# EAGLE design Matrix_Game_Board (EAGLE 6.5.0)
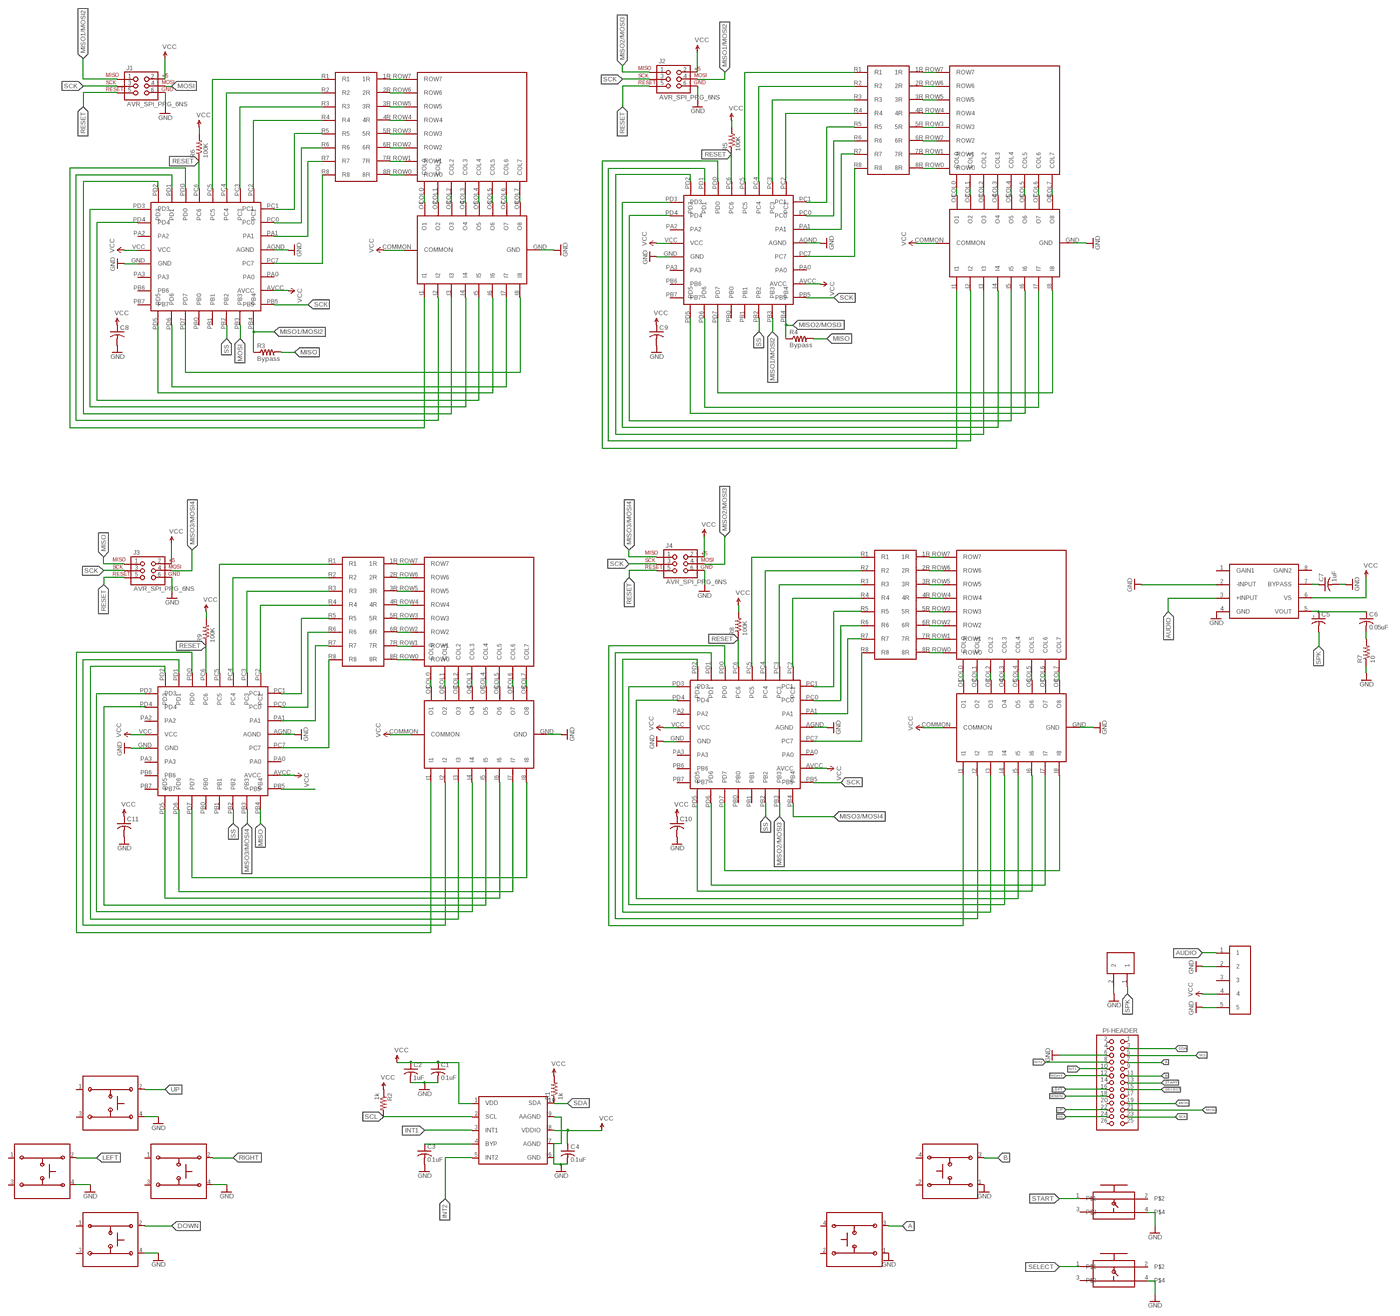
[diagram p0: schematic, sheet 1, overview]
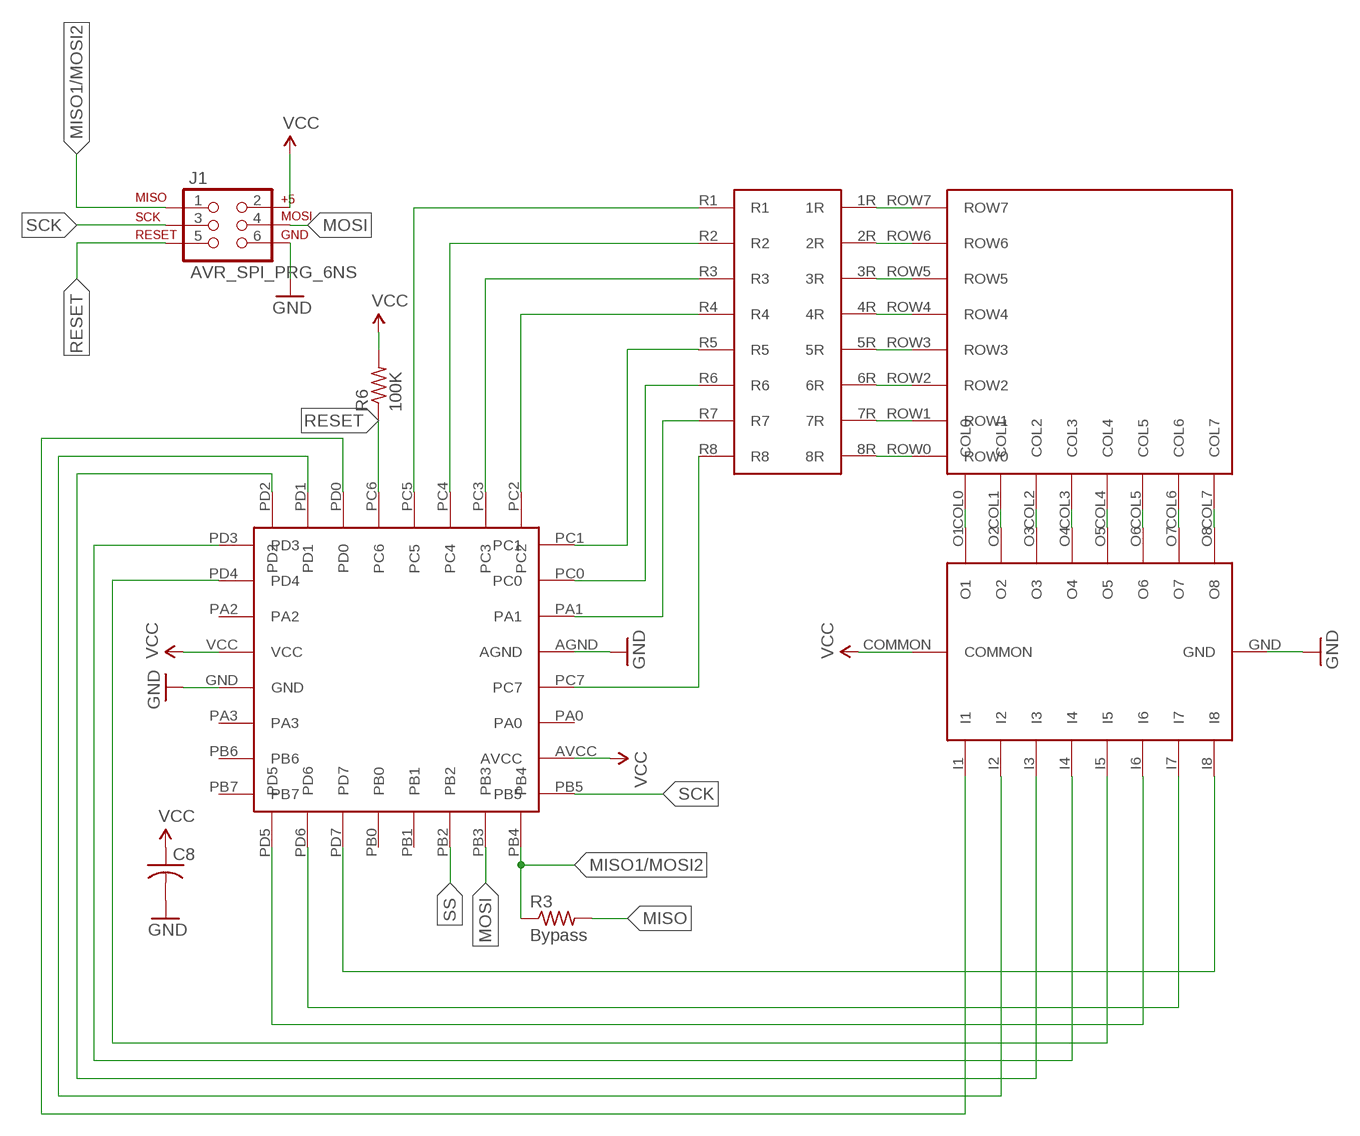
[diagram p1: schematic, sheet 1, part 1 of 4]
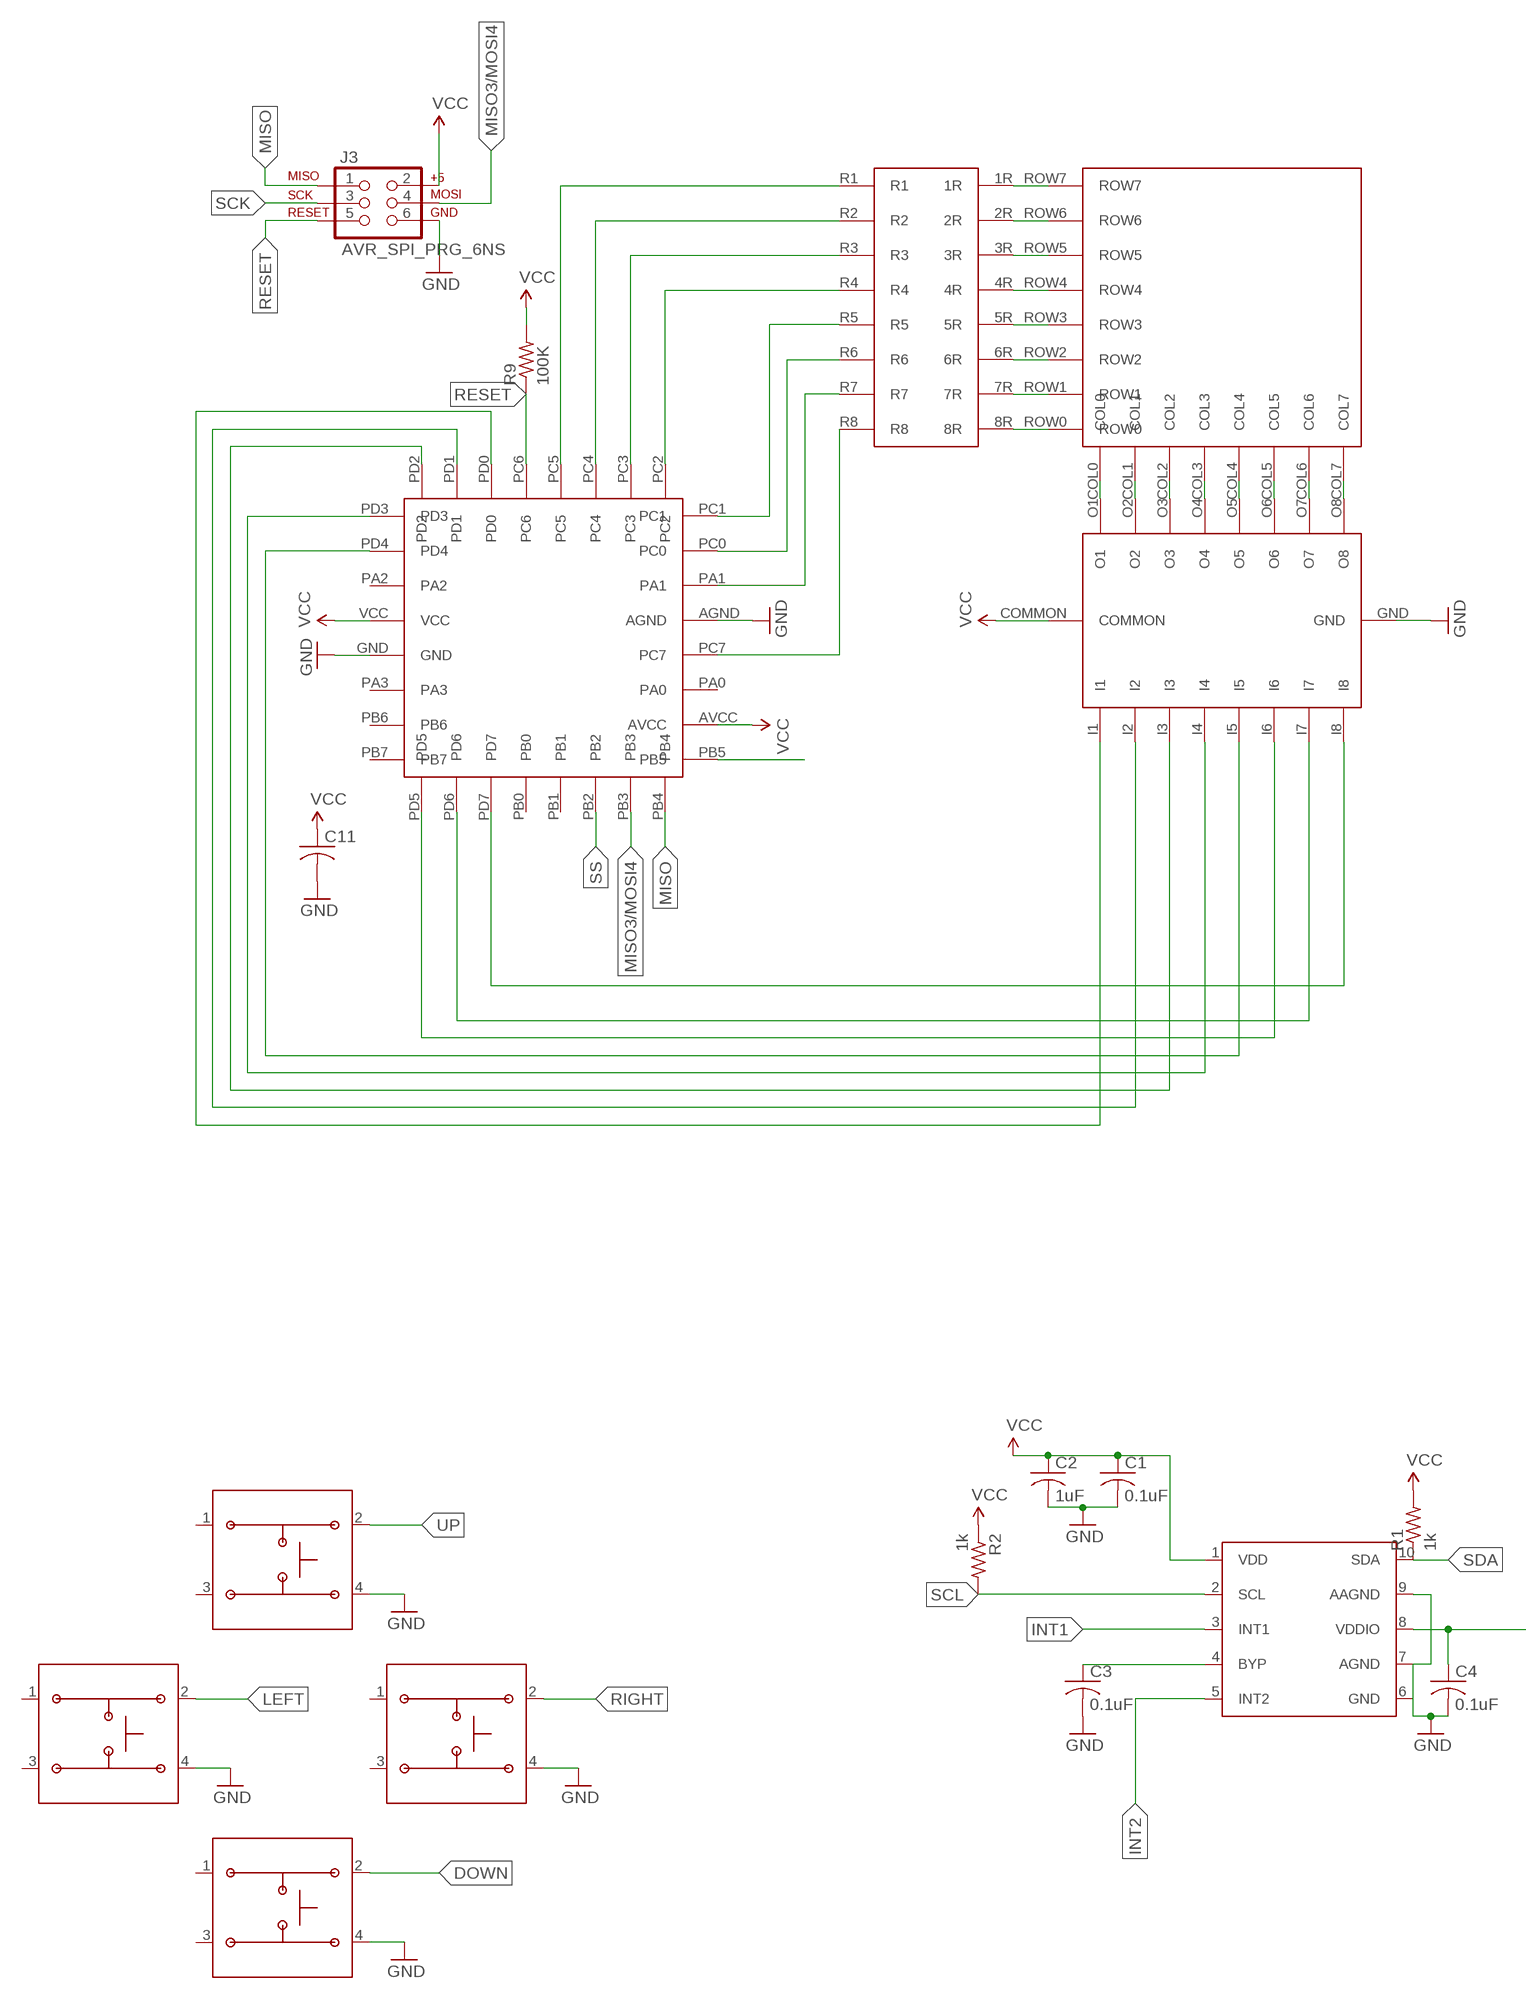
[diagram p2: schematic, sheet 1, part 2 of 4]
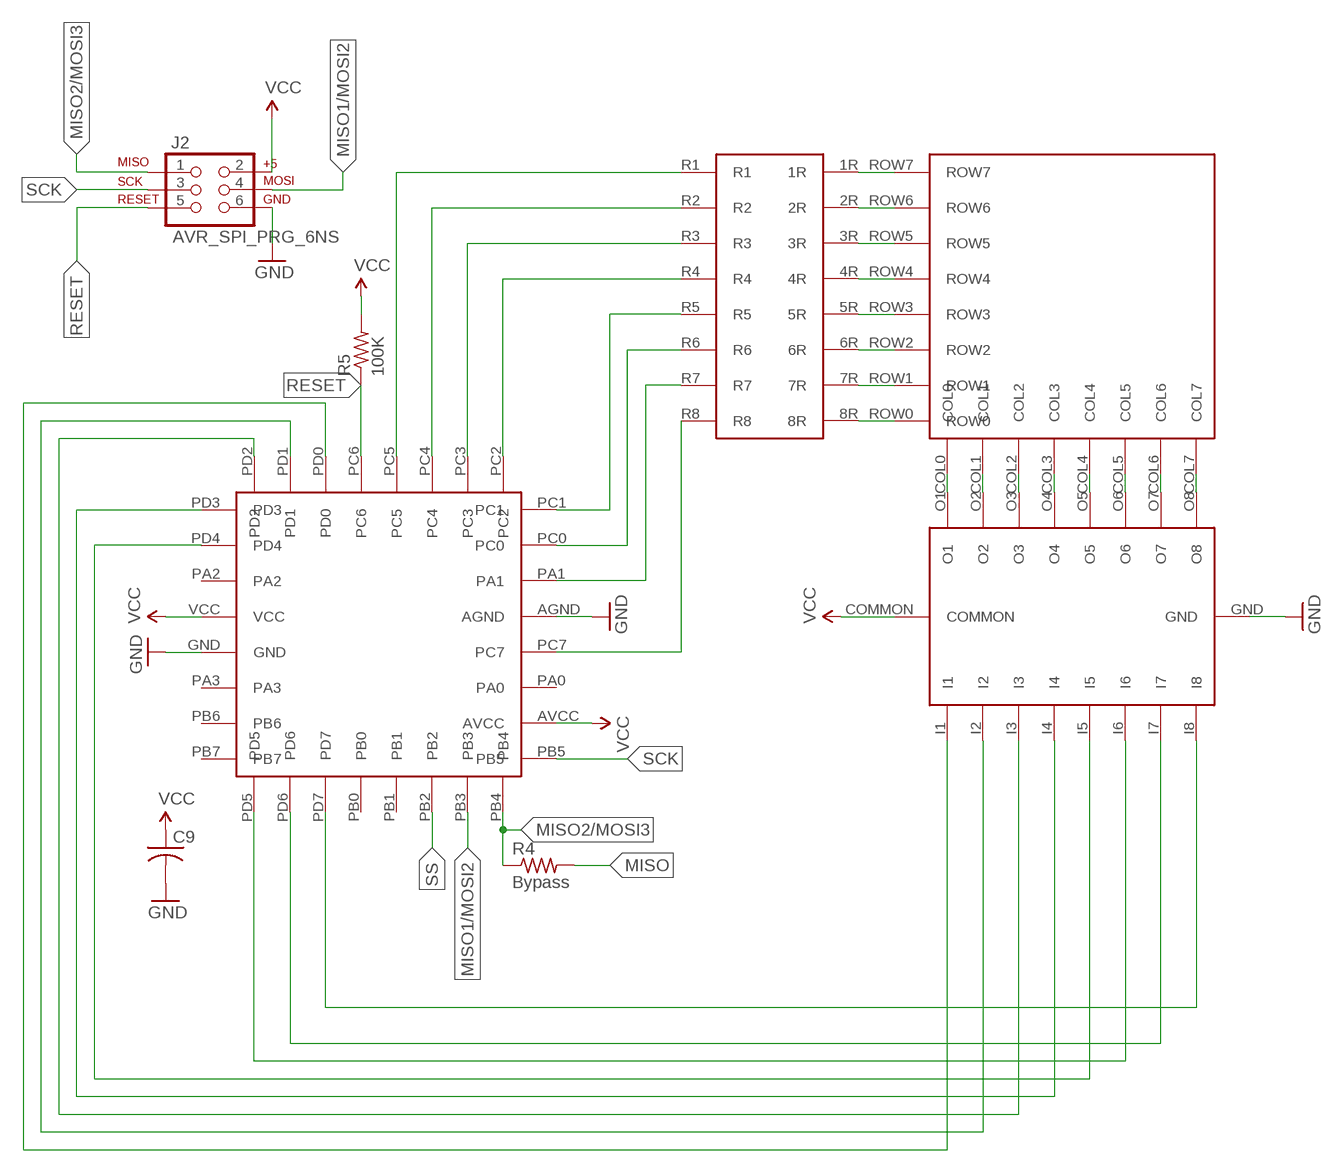
[diagram p3: schematic, sheet 1, part 3 of 4]
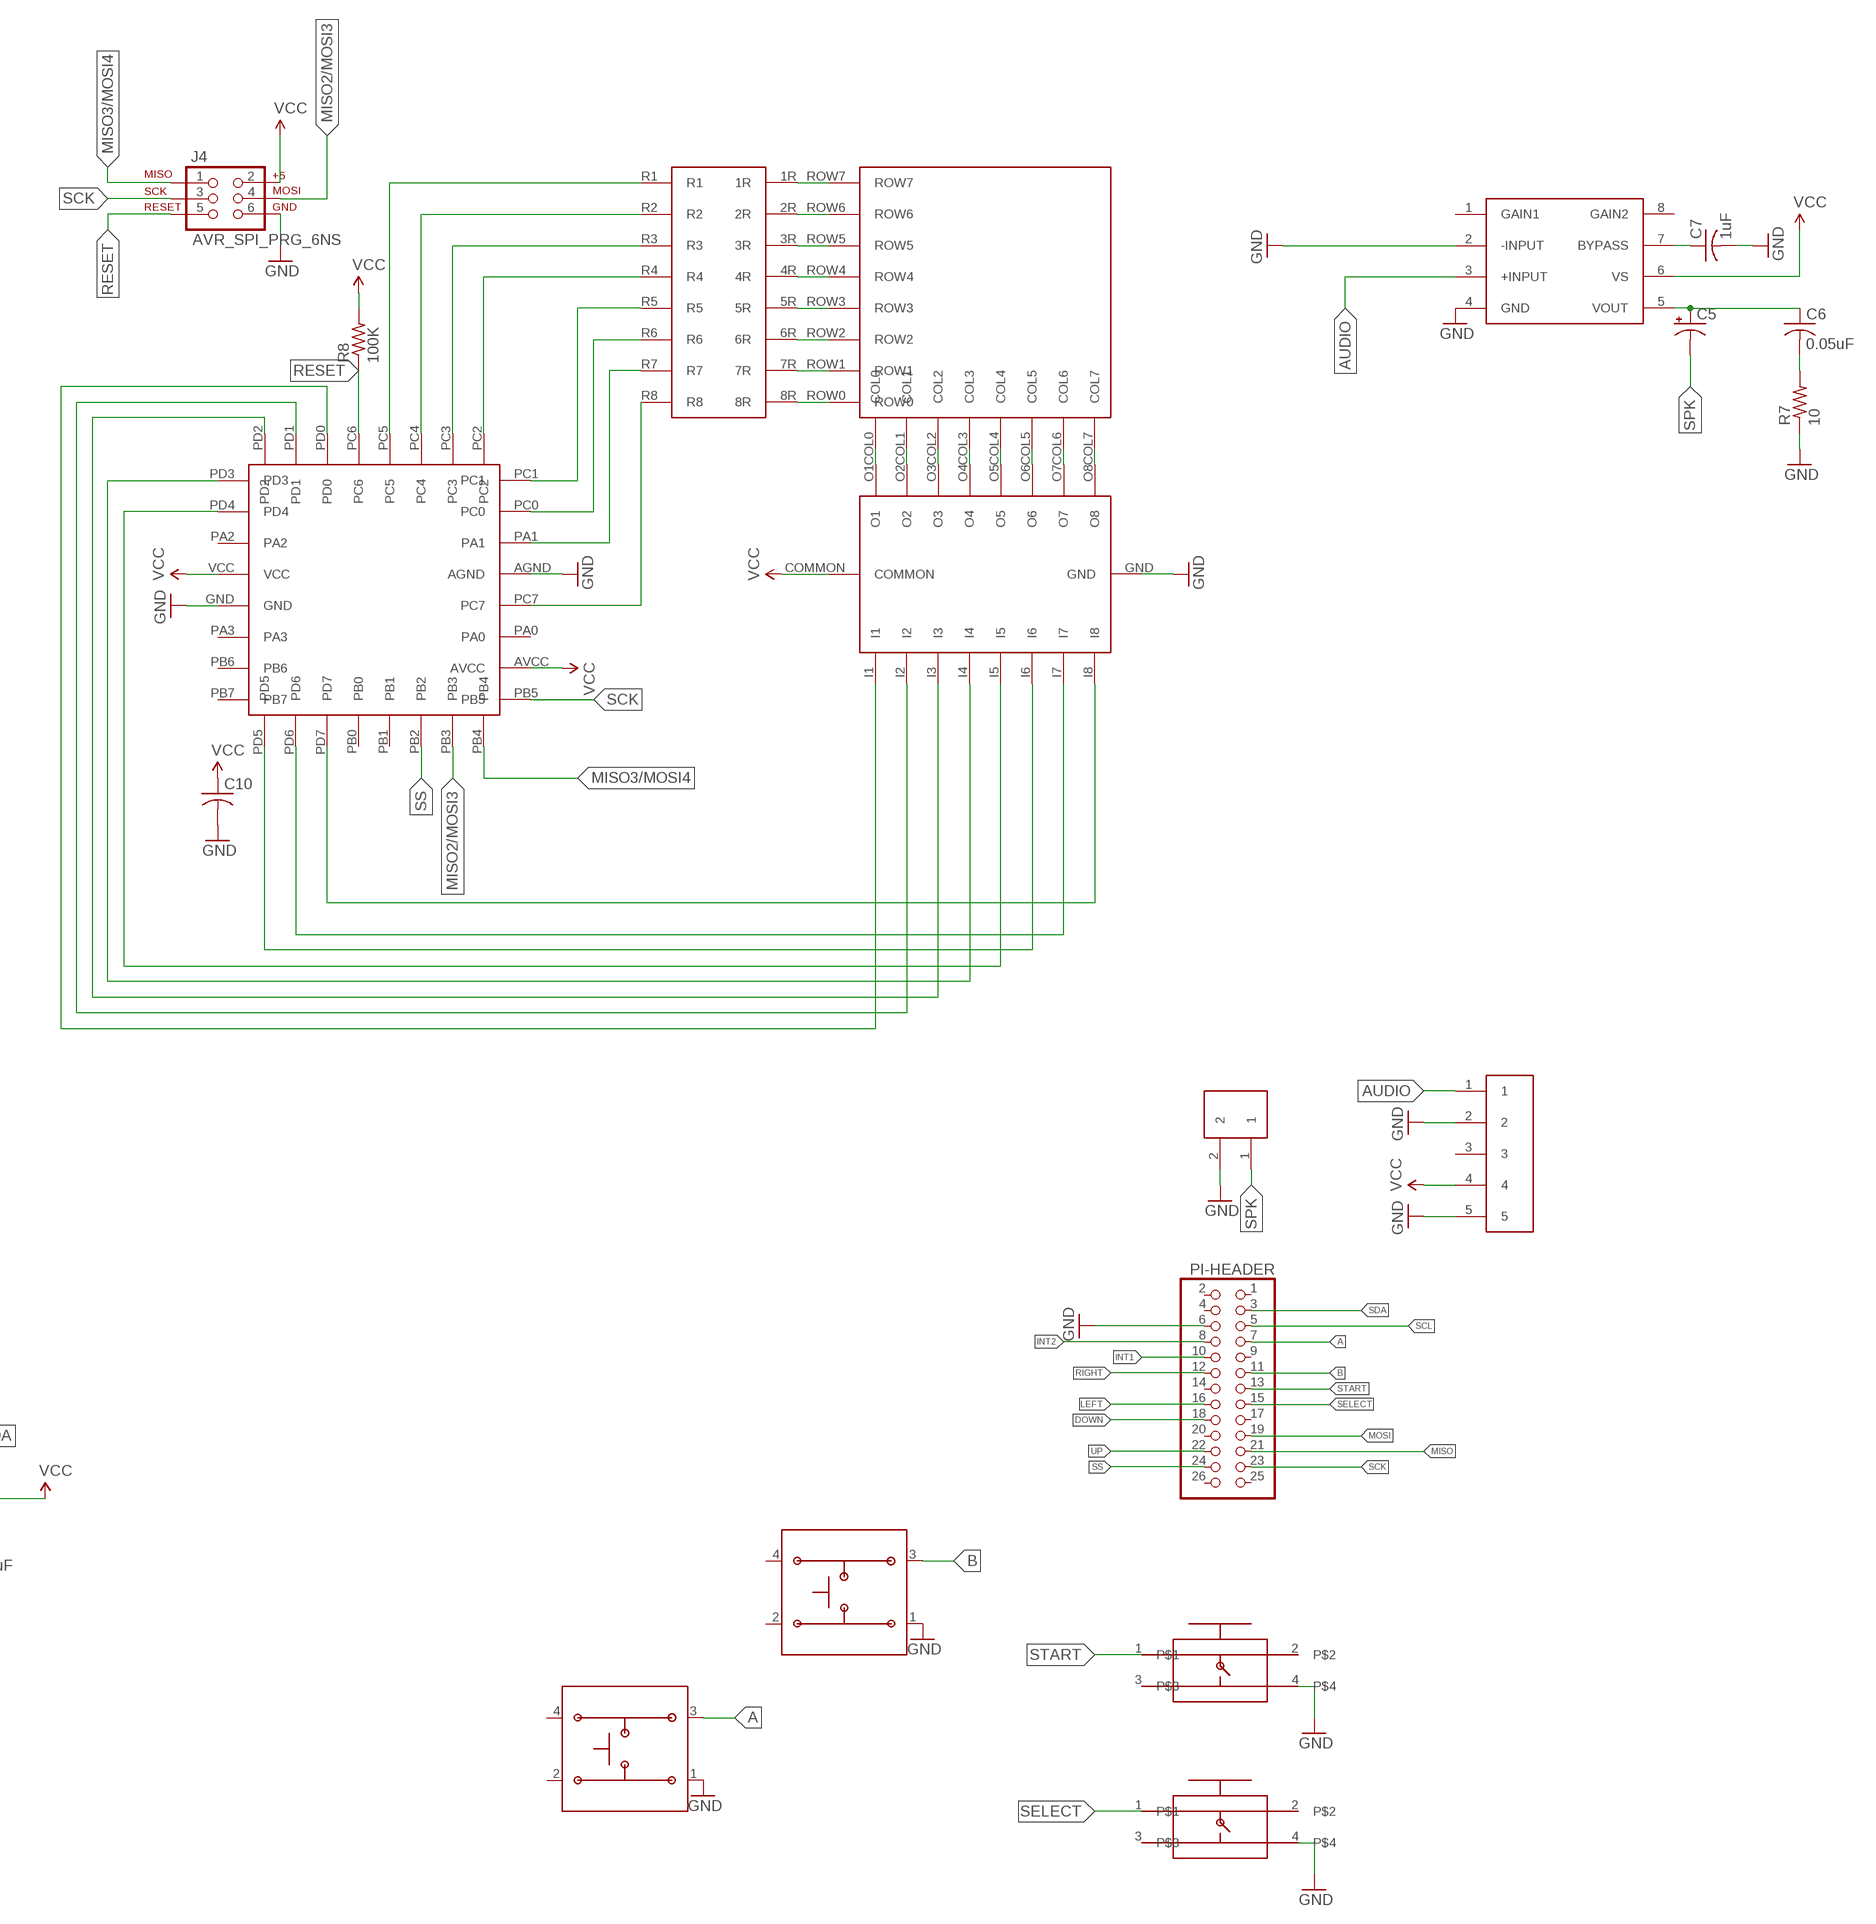
[diagram p4: schematic, sheet 1, part 4 of 4]

## Parts
C1  0.1uF  C-USC0603  [C0603]
C2  1uF  C-USC0603  [C0603]
C3  0.1uF  C-USC0603  [C0603]
C4  0.1uF  C-USC0603  [C0603]
C5  CPOL-US153CLV-0605  [153CLV-0605]
C6  0.05uF  C-USC0603  [C0603]
C7  1uF  C-USC0603  [C0603]
C8  C-USC0603  [C0603]
C9  C-USC0603  [C0603]
C10  C-USC0603  [C0603]
C11  C-USC0603  [C0603]
J1  AVR_SPI_PRG_6NS  [2X3-NS]
J2  AVR_SPI_PRG_6NS  [2X3-NS]
J3  AVR_SPI_PRG_6NS  [2X3-NS]
J4  AVR_SPI_PRG_6NS  [2X3-NS]
PI-HEADER  PINHD-2X13  [2X13]
R1  1k  R-US_R0603  [R0603]
R2  1k  R-US_R0603  [R0603]
R3  Bypass  R-US_R0603  [R0603]
R4  Bypass  R-US_R0603  [R0603]
R5  100K  R-US_R0603  [R0603]
R6  100K  R-US_R0603  [R0603]
R7  10  R-US_R0603  [R0603]
R8  100K  R-US_R0603  [R0603]
R9  100K  R-US_R0603  [R0603]
U$1  8X8_LED_MATRIX  [8X8_LED_MATRIX]
U$2  RES_ARRAY  [RES_ARRAY]
U$3  8X8_LED_MATRIX  [8X8_LED_MATRIX]
U$4  ULN2803AFWG  [ULN2803AFWG]
U$5  ULN2803AFWG  [ULN2803AFWG]
U$6  ATTINY48  [ATTINY48]
U$7  RES_ARRAY  [RES_ARRAY]
U$8  8X8_LED_MATRIX  [8X8_LED_MATRIX]
U$9  ATTINY48  [ATTINY48]
U$10  ULN2803AFWG  [ULN2803AFWG]
U$11  ATTINY48  [ATTINY48]
U$12  RES_ARRAY  [RES_ARRAY]
U$13  8X8_LED_MATRIX  [8X8_LED_MATRIX]
U$14  ULN2803AFWG  [ULN2803AFWG]
U$15  ATTINY48  [ATTINY48]
U$16  RES_ARRAY  [RES_ARRAY]
U$17  12X12MM_BUTTON  [12X12MM_BUTTON]
U$18  12X12MM_BUTTON  [12X12MM_BUTTON]
U$19  12X12MM_BUTTON  [12X12MM_BUTTON]
U$20  12X12MM_BUTTON  [12X12MM_BUTTON]
U$21  12X12MM_BUTTON  [12X12MM_BUTTON]
U$22  12X12MM_BUTTON  [12X12MM_BUTTON]
U$23  MMA8653FCR1  [MMA8653FCR1]
U$24  SMDTACTILE  [SMDTACTILE]
U$25  LM386  [LM386]
U$26  SMDTACTILE  [SMDTACTILE]
U$29  DF3_1X2  [DF3_1X2]
U$30  DF3_1X5  [DF3_1X5]

## Nets
A: PI-HEADER.7 U$22.3
AUDIO: U$25.3(+INPUT) U$30.1
B: PI-HEADER.11 U$21.3
DOWN: PI-HEADER.18 U$20.2
GND: C1.2 C2.2 C3.2 C4.2 C7.2 C8.2 C9.2 C10.2 C11.2 J1.6 J2.6 J3.6 J4.6 PI-HEADER.6 R7.1 U$4.GND U$5.GND U$6.AGND U$6.GND U$9.AGND U$9.GND U$10.GND U$11.AGND U$11.GND U$14.GND U$15.AGND U$15.GND U$17.4 U$18.4 U$19.4 U$20.4 U$21.1 U$22.1 U$23.6(GND) U$23.7(AGND) U$23.9(AAGND) U$24.4 U$25.2(-INPUT) U$25.4(GND) U$26.4 U$29.2 U$30.2 U$30.5
INT1: PI-HEADER.10 U$23.3(INT1)
INT2: PI-HEADER.8 U$23.5(INT2)
LEFT: PI-HEADER.16 U$18.2
MISO: J3.1 PI-HEADER.21 R3.2 R4.2 U$11.PB4
MISO1/MOSI2: J1.1 J2.4 R3.1 U$6.PB3 U$9.PB4
MISO2/MOSI3: J2.1 J4.4 R4.1 U$6.PB4 U$15.PB3
MISO3/MOSI4: J3.4 J4.1 U$11.PB3 U$15.PB4
MOSI: J1.4 PI-HEADER.19 U$9.PB3
N$1: U$1.COL0 U$5.O1
N$2: U$1.COL1 U$5.O2
N$3: U$1.COL2 U$5.O3
N$4: U$1.COL3 U$5.O4
N$5: U$1.COL4 U$5.O5
N$6: U$1.COL5 U$5.O6
N$7: U$1.COL6 U$5.O7
N$8: U$1.COL7 U$5.O8
N$9: U$1.ROW7 U$2.1R
N$10: U$1.ROW6 U$2.2R
N$11: U$1.ROW5 U$2.3R
N$12: U$1.ROW4 U$2.4R
N$13: U$1.ROW3 U$2.5R
N$14: U$1.ROW2 U$2.6R
N$15: U$1.ROW1 U$2.7R
N$16: U$1.ROW0 U$2.8R
N$17: U$5.I1 U$9.PD0
N$18: U$5.I2 U$9.PD1
N$19: U$5.I3 U$9.PD2
N$20: U$5.I4 U$9.PD3
N$21: U$5.I5 U$9.PD4
N$22: U$5.I6 U$9.PD5
N$23: U$5.I7 U$9.PD6
N$24: U$5.I8 U$9.PD7
N$25: U$2.R7 U$9.PA1
N$26: U$2.R8 U$9.PC7
N$27: U$2.R6 U$9.PC0
N$28: U$2.R5 U$9.PC1
N$29: U$2.R4 U$9.PC2
N$30: U$2.R3 U$9.PC3
N$31: U$2.R2 U$9.PC4
N$32: U$2.R1 U$9.PC5
N$33: C7.1 U$25.7(BYPASS)
N$34: C3.1 U$23.4(BYP)
N$35: C5.+ C6.1 U$25.5(VOUT)
N$36: U$3.COL0 U$4.O1
N$37: C6.2 R7.2
N$38: U$3.COL1 U$4.O2
N$39: U$3.COL2 U$4.O3
N$40: U$3.COL3 U$4.O4
N$41: U$3.COL4 U$4.O5
N$42: U$3.COL5 U$4.O6
N$43: U$3.COL6 U$4.O7
N$44: U$3.COL7 U$4.O8
N$45: U$3.ROW7 U$7.1R
N$46: U$3.ROW6 U$7.2R
N$47: U$3.ROW5 U$7.3R
N$48: U$3.ROW4 U$7.4R
N$49: U$3.ROW3 U$7.5R
N$50: U$3.ROW2 U$7.6R
N$51: U$3.ROW1 U$7.7R
N$52: U$3.ROW0 U$7.8R
N$53: U$4.I1 U$6.PD0
N$54: U$4.I2 U$6.PD1
N$55: U$4.I3 U$6.PD2
N$56: U$4.I4 U$6.PD3
N$57: U$4.I5 U$6.PD4
N$58: U$4.I6 U$6.PD5
N$59: U$4.I7 U$6.PD6
N$60: U$4.I8 U$6.PD7
N$61: U$6.PA1 U$7.R7
N$62: U$6.PC7 U$7.R8
N$63: U$6.PC0 U$7.R6
N$64: U$6.PC1 U$7.R5
N$65: U$6.PC2 U$7.R4
N$66: U$6.PC3 U$7.R3
N$67: U$6.PC4 U$7.R2
N$68: U$6.PC5 U$7.R1
N$69: U$15.PA1 U$16.R7
N$70: U$8.COL0 U$10.O1
N$71: U$8.COL1 U$10.O2
N$72: U$8.COL2 U$10.O3
N$73: U$8.COL3 U$10.O4
N$74: U$8.COL4 U$10.O5
N$75: U$8.COL5 U$10.O6
N$76: U$8.COL6 U$10.O7
N$77: U$8.COL7 U$10.O8
N$78: U$8.ROW7 U$12.1R
N$79: U$8.ROW6 U$12.2R
N$80: U$8.ROW5 U$12.3R
N$81: U$8.ROW4 U$12.4R
N$82: U$8.ROW3 U$12.5R
N$83: U$8.ROW2 U$12.6R
N$84: U$8.ROW1 U$12.7R
N$85: U$8.ROW0 U$12.8R
N$86: U$10.I1 U$11.PD0
N$87: U$10.I2 U$11.PD1
N$88: U$10.I3 U$11.PD2
N$89: U$10.I4 U$11.PD3
N$90: U$10.I5 U$11.PD4
N$91: U$10.I6 U$11.PD5
N$92: U$10.I7 U$11.PD6
N$93: U$10.I8 U$11.PD7
N$94: U$11.PA1 U$12.R7
N$95: U$11.PC7 U$12.R8
N$96: U$11.PC0 U$12.R6
N$97: U$11.PC1 U$12.R5
N$98: U$11.PC2 U$12.R4
N$99: U$11.PC3 U$12.R3
N$100: U$11.PC4 U$12.R2
N$101: U$11.PC5 U$12.R1
N$102: U$15.PC7 U$16.R8
N$103: U$13.COL0 U$14.O1
N$104: U$13.COL1 U$14.O2
N$105: U$13.COL2 U$14.O3
N$106: U$13.COL3 U$14.O4
N$107: U$13.COL4 U$14.O5
N$108: U$13.COL5 U$14.O6
N$109: U$13.COL6 U$14.O7
N$110: U$13.COL7 U$14.O8
N$111: U$13.ROW7 U$16.1R
N$112: U$13.ROW6 U$16.2R
N$113: U$13.ROW5 U$16.3R
N$114: U$13.ROW4 U$16.4R
N$115: U$13.ROW3 U$16.5R
N$116: U$13.ROW2 U$16.6R
N$117: U$13.ROW1 U$16.7R
N$118: U$13.ROW0 U$16.8R
N$119: U$14.I1 U$15.PD0
N$120: U$14.I2 U$15.PD1
N$121: U$14.I3 U$15.PD2
N$122: U$14.I4 U$15.PD3
N$123: U$14.I5 U$15.PD4
N$124: U$14.I6 U$15.PD5
N$125: U$14.I7 U$15.PD6
N$126: U$14.I8 U$15.PD7
N$129: U$15.PC0 U$16.R6
N$130: U$15.PC1 U$16.R5
N$131: U$15.PC2 U$16.R4
N$132: U$15.PC3 U$16.R3
N$133: U$15.PC4 U$16.R2
N$134: U$15.PC5 U$16.R1
RESET: J1.5 J2.5 J3.5 J4.5 R5.1 R6.1 R8.1 R9.1 U$6.PC6 U$9.PC6 U$11.PC6 U$15.PC6
RIGHT: PI-HEADER.12 U$19.2
SCK: J1.3 J2.3 J3.3 J4.3 PI-HEADER.23 U$6.PB5 U$9.PB5 U$11.PB5 U$15.PB5
SCL: PI-HEADER.5 R2.2 U$23.2(SCL)
SDA: PI-HEADER.3 R1.1 U$23.10(SDA)
SELECT: PI-HEADER.15 U$26.1
SPK: C5.- U$29.1
SS: PI-HEADER.24 U$6.PB2 U$9.PB2 U$11.PB2 U$15.PB2
START: PI-HEADER.13 U$24.1
UP: PI-HEADER.22 U$17.2
VCC: C1.1 C2.1 C4.1 C8.1 C9.1 C10.1 C11.1 J1.2 J2.2 J3.2 J4.2 R1.2 R2.1 R5.2 R6.2 R8.2 R9.2 U$4.COMMON U$5.COMMON U$6.AVCC U$6.VCC U$9.AVCC U$9.VCC U$10.COMMON U$11.AVCC U$11.VCC U$14.COMMON U$15.AVCC U$15.VCC U$23.1(VDD) U$23.8(VDDIO) U$25.6(VS) U$30.4
Unconnected: PI-HEADER.1 PI-HEADER.2 PI-HEADER.4 PI-HEADER.9 PI-HEADER.14 PI-HEADER.17 PI-HEADER.20 PI-HEADER.25 PI-HEADER.26 U$6.PA0 U$6.PA2 U$6.PA3 U$6.PB0 U$6.PB1 U$6.PB6 U$6.PB7 U$9.PA0 U$9.PA2 U$9.PA3 U$9.PB0 U$9.PB1 U$9.PB6 U$9.PB7 U$11.PA0 U$11.PA2 U$11.PA3 U$11.PB0 U$11.PB1 U$11.PB6 U$11.PB7 U$15.PA0 U$15.PA2 U$15.PA3 U$15.PB0 U$15.PB1 U$15.PB6 U$15.PB7 U$17.1 U$17.3 U$18.1 U$18.3 U$19.1 U$19.3 U$20.1 U$20.3 U$21.2 U$21.4 U$22.2 U$22.4 U$24.2 U$24.3 U$25.1(GAIN1) U$25.8(GAIN2) U$26.2 U$26.3 U$30.3

## Library data of the parts
C1-C4 C6-C11 = resistor:C-US: CAPACITOR, American symbol
C5 = resistor:CPOL-US: POLARIZED CAPACITOR, American symbol
J1-J4 = SparkFun-Connectors:AVR_SPI_PRG_6: AVR ISP 6 Pin This is the reduced ISP connector for AVR programming. Common on Arduino. This footprint will take up less PCB space and can be used with a 10-pin to 6-pin adapter such as SKU: BOB-08508 **Special note about "TEST_POINT" package. The stop mask is on the top side, so if you want your programming test points to be on the bottom of your board, make sure to place this package on the bottom side of the board. This also ensure that the orientation to program from the bottom side will be correct.
PI-HEADER = pinhead:PINHD-2X13: PIN HEADER
R1-R9 = resistor:R-US_: RESISTOR, American symbol
U$1 U$3 U$8 U$13 = ScottSilver:8X8_LED_MATRIX
U$2 U$7 U$12 U$16 = ScottSilver:RES_ARRAY
U$4 U$5 U$10 U$14 = ScottSilver:ULN2803AFWG
U$6 U$9 U$11 U$15 = ScottSilver:ATTINY48
U$17-U$22 = ScottSilver:12X12MM_BUTTON
U$23 = ScottSilver:MMA8653FCR1
U$24 U$26 = ScottSilver:SMDTACTILE
U$25 = ScottSilver:LM386
U$29 = ScottSilver:DF3_1X2
U$30 = ScottSilver:DF3_1X5

## Board
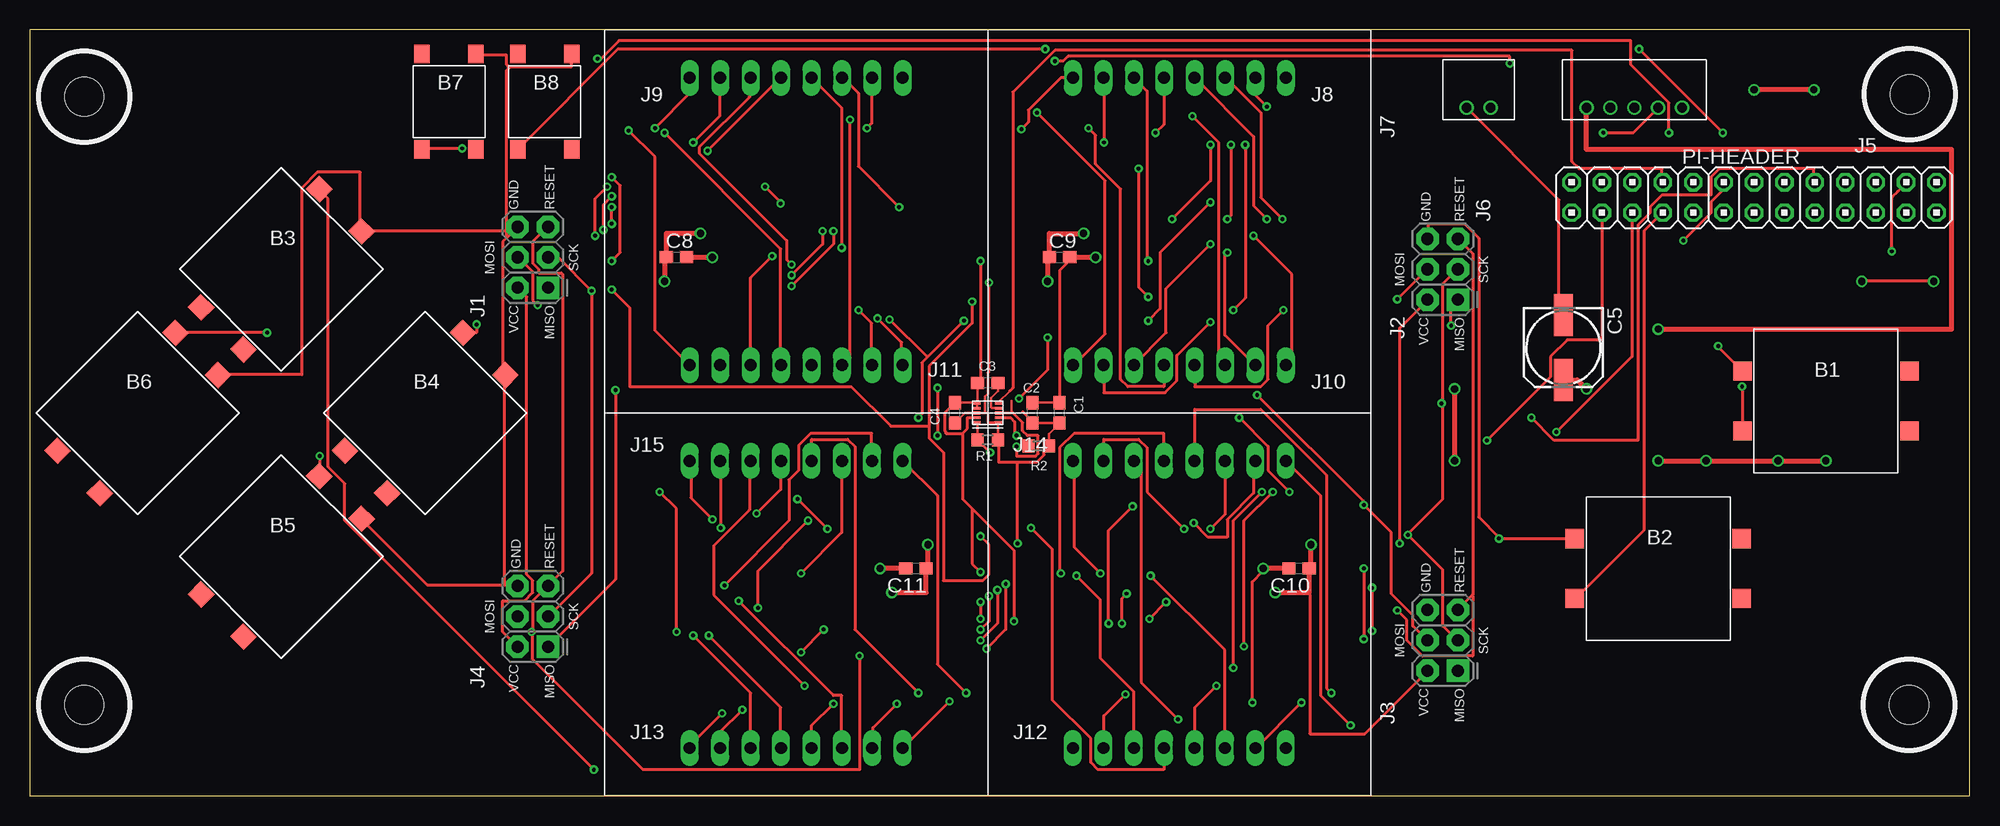
[diagram p5: board, top side]
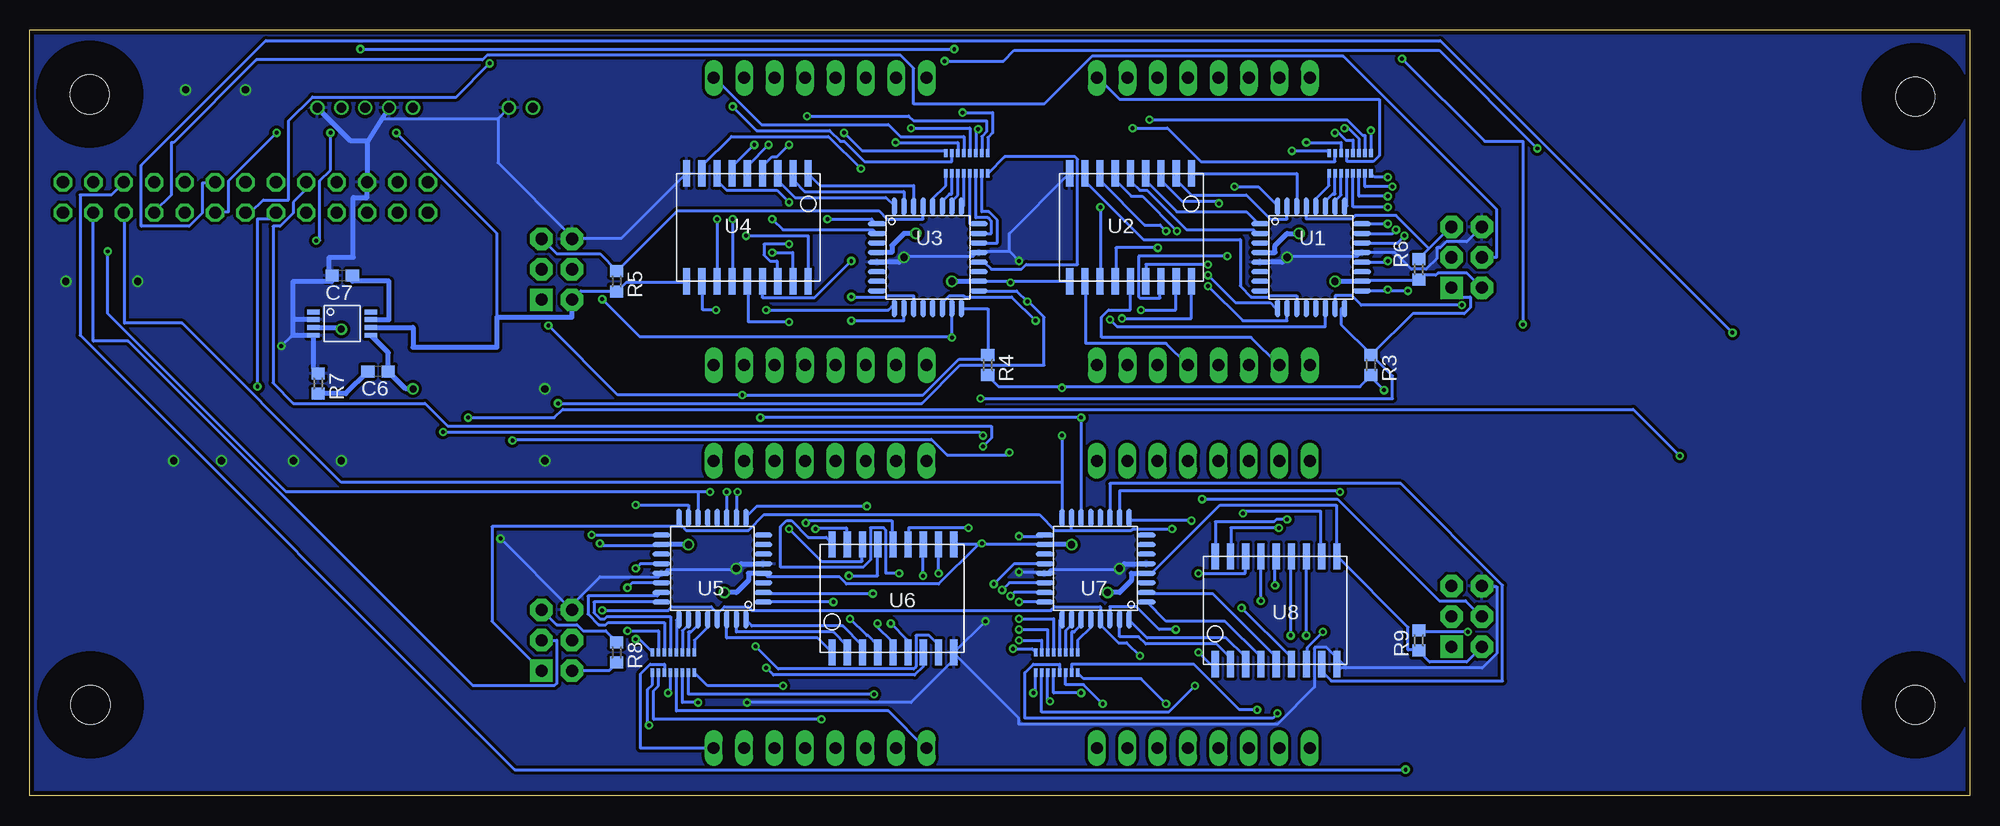
[diagram p6: board, bottom side, seen from below]

Size 162 x 64 mm. Coordinates in mm from the lower left corner, seen from the top.
Outline: 0,0 162,0 162,64 0,64 0,0
Copper layers (1*16): Top 0.0356mm / dielectric 1.5011mm / Bottom 0.0356mm
Design rules "LaenPCBOrder *": minimum track width 8mil, minimum drill 13mil, track to track 6mil, track to pad 6mil, pad to pad 6mil, via to via 6mil, smd to smd 6mil, copper to edge 15mil, drill to drill 6mil, minimum pad ring 7mil, minimum via ring 7mil, stop-mask expansion 3mil, vias tented up to drill 0mil, thermal gap 10mil
Holes 3.26 mm at 4.54,7.62 4.54,58.42 156.94,7.62 157,58.62
tRestrict: area 0.5,3.6 to 8.5,11.6; area 0.5,54.4 to 8.5,62.4; area 152.9,3.6 to 160.9,11.6; area 153,54.6 to 161,62.6; area 135,38 to 162,40; area 160.5,38 to 162,55; area 129,53 to 162,55; area 129,53 to 131,59
bRestrict: area 0.5,3.6 to 8.5,11.6; area 0.5,54.4 to 8.5,62.4; area 152.9,3.6 to 160.9,11.6; area 153,54.6 to 161,62.6
vRestrict: area 86,58 to 106,62; area 86,34 to 106,38; area 96,50 to 108,54; area 96,41 to 108,45; area 84,10 to 96,14; area 84,19 to 96,23; area 64,50 to 76,54; area 52,9 to 64,13; area 52,18 to 64,22; area 64,41 to 76,45; area 81,51 to 87,55; area 54,58 to 74,62; 16 more areas

### Footprints (pad centres in the part's own frame; a part is rotated, then mirrored left to right if it is on the bottom)
C0603 = smd 1.1 x 1: 1 -0.85,0; 2 0.85,0
153CLV-0605 = smd 3.5 x 1.6: + 2.7,0; - -2.7,0
2X3-NS = drill 1.016 pad 1.88 square: 1 -2.54,-1.27 | drill 1.016 pad 1.88 octagon: 2 -2.54,1.27; 3 0,-1.27; 4 0,1.27; 5 2.54,-1.27; 6 2.54,1.27
2X13 = drill 1.016 octagon: 1 -15.24,-1.27; 2 -15.24,1.27; 3 -12.7,-1.27; 4 -12.7,1.27; 5 -10.16,-1.27; 6 -10.16,1.27; 7 -7.62,-1.27; 8 -7.62,1.27; 9 -5.08,-1.27; 10 -5.08,1.27; 11 -2.54,-1.27; 12 -2.54,1.27; 13 0,-1.27; 14 0,1.27; 15 2.54,-1.27; 16 2.54,1.27; 17 5.08,-1.27; 18 5.08,1.27; 19 7.62,-1.27; 20 7.62,1.27; 21 10.16,-1.27; 22 10.16,1.27; 23 12.7,-1.27; 24 12.7,1.27; 25 15.24,-1.27; 26 15.24,1.27
R0603 = smd 1 x 1.1: 1 -0.85,0; 2 0.85,0
8X8_LED_MATRIX = drill 1 long: COL0 8.89,-12; COL1 6.35,-12; COL2 -3.81,-12; COL3 -3.81,12; COL4 -6.35,-12; COL5 1.27,12; COL6 3.81,12; COL7 1.27,-12; ROW0 -8.89,-12; ROW1 3.81,-12; ROW2 -8.89,12; ROW3 -1.27,-12; ROW4 8.89,12; ROW5 -6.35,12; ROW6 6.35,12; ROW7 -1.27,12
RES_ARRAY = smd 0.7 x 0.3: 1R 1.7,3.5; 2R 1.7,3; 3R 1.7,2.5; 4R 1.7,2; 5R 1.7,1.5; 6R 1.7,1; 7R 1.7,0.5; 8R 1.7,0; R1 0,3.5; R2 0,3; R3 0,2.5; R4 0,2; R5 0,1.5; R6 0,1; R7 0,0.5; R8 0,0
ULN2803AFWG = smd 0.6 x 2.2: COMMON 10.16,9.01; GND 10.16,0; I1 0,0; I2 1.27,0; I3 2.54,0; I4 3.81,0; I5 5.08,0; I6 6.35,0; I7 7.62,0; I8 8.89,0; O1 0,9.01; O2 1.27,9.01; O3 2.54,9.01; O4 3.81,9.01; O5 5.08,9.01; O6 6.35,9.01; O7 7.62,9.01; O8 8.89,9.01
ATTINY48 = smd 1.5 x 0.406: AGND 4.25,0.4; AVCC 4.25,-2; GND -4.25,-0.4; PA0 4.25,-1.2; PA1 4.25,1.2; PA2 -4.25,1.2; PA3 -4.25,-1.2; PB5 4.25,-2.8; PB6 -4.25,-2; PB7 -4.25,-2.8; PC0 4.25,2; PC1 4.25,2.8; PC7 4.25,-0.4; PD3 -4.25,2.8; PD4 -4.25,2; VCC -4.25,0.4 | smd 0.406 x 1.5: PB0 -0.4,-4.25; PB1 0.4,-4.25; PB2 1.2,-4.25; PB3 2,-4.25; PB4 2.8,-4.25; PC2 2.8,4.25; PC3 2,4.25; PC4 1.2,4.25; PC5 0.4,4.25; PC6 -0.4,4.25; PD0 -1.2,4.25; PD1 -2,4.25; PD2 -2.8,4.25; PD5 -2.8,-4.25; PD6 -2,-4.25; PD7 -1.2,-4.25
12X12MM_BUTTON = smd 1.55 x 1.6: 1 -6.975,2.5; 2 6.975,2.5; 3 -6.975,-2.5; 4 6.975,-2.5
MMA8653FCR1 = smd 0.6 x 0.225: 1 -0.9,0.8; 2 -0.9,0.4; 3 -0.9,0; 4 -0.9,-0.4; 5 -0.9,-0.8; 6 0.9,-0.8; 7 0.9,-0.4; 8 0.9,0; 9 0.9,0.4; 10 0.9,0.8
SMDTACTILE = smd 1.55 x 1.3: 1 -3.975,2.25; 2 3.975,2.25; 3 -3.975,-2.25; 4 3.975,-2.25
LM386 = smd 0.41 x 1.02: 1 -0.975,-2.4; 2 -0.325,-2.4; 3 0.325,-2.4; 4 0.975,-2.4; 5 0.975,2.4; 6 0.325,2.4; 7 -0.325,2.4; 8 -0.975,2.4
DF3_1X2 = drill 0.8: 1 -1,-1.5; 2 1,-1.5
DF3_1X5 = drill 0.8: 1 -4,-1.5; 2 -2,-1.5; 3 0,-1.5; 4 2,-1.5; 5 4,-1.5

### Placement (x,y rotation side)
C1  86,32 90 top
C2  83.75,32 90 top
C3  80,34.5 180 top
C4  77.25,32 90 top
C5  128.08,37.46 270 top
C6  132.92,35.46 180 bottom
C7  135.92,43.46 180 bottom
C8  54,45 0 top
C9  86,45 0 top
C10  106,19 180 top
C11  74,19 180 top
J1  42,45 90 top
J2  118,44 90 top
J3  42,15 90 top
J4  118,13 90 top
PI-HEADER  144,50 0 top
R1  80,29.75 0 top
R2  84.25,29.25 180 top
R3  50,36 270 bottom
R4  82,36 270 bottom
R5  113,43 270 bottom
R6  46,44 270 bottom
R7  137.92,34.46 270 bottom
R8  113,12 270 bottom
R9  46,13 270 bottom
U$1  64,48 0 top
U$2  50,52 90 bottom
U$3  96,48 0 top
U$4  97,52 180 bottom
U$5  65,52 180 bottom
U$6  87,45 0 bottom
U$7  82,52 90 bottom
U$8  64,16 180 top
U$9  55,45 0 bottom
U$10  63,11 0 bottom
U$11  73,19 180 bottom
U$12  78,12 270 bottom
U$13  96,16 180 top
U$14  95,12 0 bottom
U$15  105,19 180 bottom
U$16  110,12 270 bottom
U$17  21,44 45 top
U$18  9,32 45 top
U$19  33,32 45 top
U$20  21,20 45 top
U$21  150,33 0 top
U$22  136,19 0 top
U$23  80,32 180 top
U$24  35,58 90 top
U$25  135.92,39.46 270 bottom
U$26  43,58 90 top
U$29  121,59 0 top
U$30  134,59 0 top

### Tracks (layer width: path | path; a pad name or v marks a point on that pad's centre or on a via)
A
  Top 0.254: U$22.3 129.1,16.5 134.8,22.2 134.8,47.2 136.3,48.7 PI-HEADER.7
AUDIO  (via drill 0.6)
  Top 0.406: U$30.1 130,54 160.5,54 160.5,39 v136,39
  Bottom 0.406: U$25.3 136,39.13 v136,39
B  (via drill 0.33)
  Top 0.254: v143,34.2 143,30.5 U$21.3
  Bottom 0.254: v143,34.2 143,48.2 142,48.2 141.5,48.7 PI-HEADER.11
DOWN  (via drill 0.33)
  Top 0.254: v24.2,28.4 24.2,26.7 U$20.2 | v125.4,31.6 127.3,29.7 134.3,29.7 134.3,47.7 135.3,48.7 135.3,49.2 136.3,50.2 140.4,50.2 140.4,51.7 141.1,52.4 149,52.4 149,51.3 PI-HEADER.18
  Bottom 0.254: v24.2,28.4 28.1,32.3 117.5,32.3 118.2,31.6 v125.4,31.6
GND  (via drill 0.33, 0.6)
  Top 0.203: C4.2 79.05,32.85 U$23.6 | C3.2 79.15,32.85 U$23.6 | C2.2 C1.2 | U$23.6 U$23.7
  Top 0.254: 86.3,32.9 86,32.9 C1.2 86,43.9 86.8,44.7 C9.2 86.8,44.8 | 77.6,32.9 C4.2 76.4,32 76.4,30.5 76.5,30.4 76.5,30.3 77.9,30.3 | 79.4,34.7 79.2,34.5 C3.2 | 79.4,34.8 C3.2 | 56.8,45.2 v57,45 | 84,32.9 C2.2 | C3.2 79.4,34.9 v79.4,44.7 | 102.8,19 v103,19 103,18.8 102.1,17.9 v102.1,7.8 | U$22.1 v122.7,21.5 122.7,21.6 121,23.3 121,46.6 119.8,47.8 116.8,47.8 116.8,46.6 J2.6 | v141,37.6 141,37.5 143,35.5 U$21.1 | U$23.9 78.3,31.6 78.3,30.7 77.9,30.3 | v82.2,14.6 82.2,20.5 78.75,23.95 | 78.75,23.95 77.9,24.8 77.9,30.3 | v79.4,18.7 78.7,19.4 78.7,23.9 78.75,23.95 | 39.6,17.6 40.7,17.6 J3.6 | 39.6,17.6 33.2,17.6 27.7,23.1 U$20.4 | U$18.4 15.7,35.2 22.7,35.2 22.7,50.8 24,52.1 27.6,52.1 27.6,47.2 U$17.4 27.8,47.2 39.8,47.2 | 40,60.9 39.8,61.1 39.8,61.9 37.3,61.9 U$24.4 | 40,60.9 45.2,60.9 45.2,61.9 U$26.4 | 39.85,46.65 40.7,47.5 J1.6 | 39.85,46.65 39.5,46.3 39.5,35.3 39.6,35.2 U$19.4 39.6,35.1 39.6,17.6 | 39.8,47.2 39.8,46.7 39.85,46.65 | 39.8,47.2 39.8,60.6 40,60.8 40,60.9 | v159,43 v153,43
  Top 0.406: C8.2 v57,45 | C10.2 v103,19 | C11.2 v71,19 | C9.2 v89,45 | v149,59 v144,59 | v136,28 v140,28 v146,28 v150,28 | v119,28 v119,34
  Bottom 0.254: 109.2,18.6 U$15.AGND | 56.9,45.1 v57,45 | 77.2,18.6 U$11.AGND | U$15.AGND 109.1,18.6 108.8,18.9 103.1,18.9 v103,19 | 56.8,45.1 v57,45 | 71.1,18.9 v71,19 71.2,18.9 76.8,18.9 77.1,18.6 U$11.AGND | 82.8,45.4 U$6.AGND | 88.9,45.1 v89,45 88.8,45.1 83.2,45.1 82.9,45.4 U$6.AGND | 82.7,45.5 U$6.AGND | v122.7,21.5 116.8,15.6 J4.6 116.9,15.8 114.4,18.3 109.5,18.3 109.3,18.5 U$15.AGND | U$4.GND 107.2,52 112.6,46.6 116.7,46.6 J2.6 116.7,46.7 122.9,52.9 122.9,56.6 | v141,37.6 140.2,38.4 140,38.48 | 122.9,56.6 U$29.2 | 122.9,56.6 132.4,56.6 132.52,56.68 | 80.2,45.5 v79.4,44.7 | 80.2,45.5 82.6,45.5 U$6.AGND | v82.2,14.6 84.8,12 U$14.GND | 80.2,45.5 80.2,47 75.2,52 U$5.GND | v79.4,18.7 77.3,18.7 U$11.AGND | 52.1,10.7 40.7,10.7 39.5,11.9 39.5,17.5 40.7,17.5 J3.6 | 52.1,10.7 52.5,10.7 52.8,11 U$10.GND | v57,45 56.7,45.1 51.1,45.1 50.8,45.4 U$9.AGND 48,45.4 46.6,44 45.4,44 44.5,44.9 44.5,45.8 44.2,45.8 43.7,46.3 42,46.3 40.8,47.5 J1.6 | U$14.GND 84.8,11.9 79.4,6.5 79.4,6 57.8,6 54.7,9.1 54.7,12.4 53.7,12.4 52.1,10.8 52.1,10.7 | v102.1,7.8 88.4,7.8 84.6,11.6 U$14.GND
  Bottom 0.406: v57,45 57.4,44.6 U$9.GND | v71,19 70.6,19.4 U$11.GND | v103,19 102.6,19.4 U$15.GND | v89,45 89.4,44.6 U$6.GND | U$25.2 140,39.78 | 140,39.78 140,43 136.77,43 C7.2 137,43.46 137,45 135,45 135,50 133.84,50 PI-HEADER.6 133.84,54.66 133.75,54.75 | R7.1 138.32,35.71 U$25.4 140,38.48 140,39.78 | U$30.2 132.52,56.68 133.75,54.75 | U$30.5 135.25,54.75 133.75,54.75
  pour Bottom (isolate 0.254): 0,64 162,64 162,0 0,0
INT1  (via drill 0.33)
  Top 0.203: U$23.3 82,32 82,33
  Top 0.254: v82.4,29.2 82.4,28.4 84,28.4 84.2,28.6 84.2,30.1 83.3,30.1 82.9,30.5 82.9,31.2 82.1,32 82,32
  Bottom 0.254: v82.4,29.2 81.7,29.9 81.7,30.9 127.1,30.9 129,32.8 140,32.8 141.7,34.5 141.7,47.6 141.1,47.6 140,48.7 140,49.6 139,50.6 139,51.2 PI-HEADER.10
INT2
  Top 0.203: U$23.5 80.9,32.9 81.85,33.85
  Top 0.254: 81.85,33.85 82.1,34.1 82.1,58.8 85.6,62.3 128.8,62.3 128.8,53 129.4,52.4 136.3,52.4 136.3,51.3 PI-HEADER.8
LEFT  (via drill 0.33)
  Top 0.254: v19.8,38.7 12.2,38.7 U$18.2
  Bottom 0.254: v19.8,38.7 44.2,63.1 142.3,63.1 152.7,52.7 152.7,47.6 148.7,47.6 147.6,48.7 147.6,51.2 146.6,51.2 PI-HEADER.16
MISO  (via drill 0.33)
  Top 0.254: v75.8,34.1 v75.8,30.1 | v48.9,33.9 48.9,18.1 43.3,12.5 J3.1
  Bottom 0.254: 75.8,34.2 81.1,34.2 82,35.1 R4.2 | 75.8,34.2 50.9,34.2 50,35.1 R3.2 50,35 v48.9,33.9 | v75.8,30.1 75.8,26.2 | 75.8,26.2 U$11.PB4 | v75.8,34.1 75.8,34.2 | 75.8,26.2 136,26.2 149.3,39.5 154.1,39.5 154.1,48.7 PI-HEADER.21
MISO1/MOSI2  (via drill 0.33)
  Top 0.254: v114.2,41.5 116.7,44 J2.4 | v82.6,33.2 85,35.6 v85,38.3
  Bottom 0.254: 52.2,40.8 U$9.PB4 | 52.1,40.7 U$9.PB4 | R3.1 50,36.9 52.5,39.4 52.5,40.7 52.3,40.7 U$9.PB4 | R3.1 49.9,36.9 46.5,40.3 42.2,40.3 41.7,40.8 41.7,41.7 42.5,41.7 43.2,42.4 J1.1 | 85,38.4 U$6.PB3 | 85,38.4 111.1,38.4 v114.2,41.5 | v82.6,33.2 48.2,33.2 48.2,35.1 49.9,36.8 R3.1 | v85,38.3 85,38.4
MISO2/MOSI3  (via drill 0.33)
  Top 0.254: J4.4 116.7,13 115.5,14.2 115.5,15.1 113.7,16.9 113.7,22 v111.4,24.3 111.4,24.6 v102.5,33.5 | v118.7,39.3 118.7,40.9 119.2,41.4 J2.1
  Bottom 0.254: U$6.PB4 84.2,40.7 82,40.7 R4.1 82.1,36.8 82.4,36.5 84.4,36.5 87.4,33.5 v102.5,33.5 112.9,33.5 v118.7,39.3 | U$15.PB3 107,24.3 v111.4,24.3
MISO3/MOSI4  (via drill 0.33)
  Top 0.254: v66.6,22.3 v64.1,24.8
  Bottom 0.254: 75,22.2 U$11.PB3 | 75,22.2 76.4,22.2 77.7,23.5 100.7,23.5 102,22.2 107.2,22.2 107.55,22.55 | 107.55,22.55 107.8,22.8 U$15.PB4 | v64.1,24.8 52.8,24.8 44.3,16.3 42.1,16.3 40.8,15 J3.4 | v66.6,22.3 69.9,22.3 70,22.2 75,22.2 | J4.1 119.3,10.5 123.4,14.6 123.4,22.5 107.6,22.5 107.55,22.55
MOSI  (via drill 0.33)
  Top 0.254: v42.4,41 42,41.4 42,43.8 40.8,45 J1.4
  Bottom 0.254: U$9.PB3 53,41.8 51.6,41.8 50.8,41 v42.4,41 | J1.4 39.5,45 39.5,49 52.3,61.8 73.3,61.8 77.3,57.8 88.2,57.8 88.2,60.8 89.3,61.9 123.8,61.9 124.2,61.5 143.1,61.5 150,54.6 150.2,54.6 150.2,50.2 151.6,48.8 PI-HEADER.19
N$1  (via drill 0.33)
  Top 0.254: v70.8,39.9 72.8,37.9 72.8,36 U$1.COL0
  Bottom 0.254: U$5.O1 65,39.9 v70.8,39.9
N$2  (via drill 0.33)
  Top 0.254: v69.2,40.6 70.3,39.5 70.3,36 U$1.COL1
  Bottom 0.254: v69.2,40.6 66.3,40.6 66.3,42.9 U$5.O2
N$3  (via drill 0.33)
  Top 0.254: v62,45.1 60.2,43.3 U$1.COL2
  Bottom 0.254: v62,45.1 69.4,45.1 69.4,41.7 69.3,41.6 67.6,41.6 67.6,42.9 U$5.O3
N$4  (via drill 0.33)
  Top 0.254: v63.6,44.4 63.2,44.8 63.2,46.4 55.9,53.7 55.9,54.2 60.1,58.4 60.1,60 U$1.COL3
  Bottom 0.254: v63.6,44.4 68.8,44.4 U$5.O4
N$5
  Bottom 0.254: U$5.O5 70.1,42.9 70.1,40.6 71.9,40.6 72.5,40 72.5,38.3 60,38.3 57.7,36 U$1.COL4
N$6  (via drill 0.33)
  Top 0.254: v67.8,45.8 67.8,57.5 65.3,60 U$1.COL5
  Bottom 0.254: v67.8,45.8 71.3,45.8 71.3,43 U$5.O6
N$7  (via drill 0.33)
  Top 0.254: v72.6,49.2 69.2,52.6 69.2,58.7 67.9,60 U$1.COL6
  Bottom 0.254: v72.6,49.2 72.6,43 U$5.O7
N$8
  Bottom 0.254: U$5.O8 73.8,42.9 73.8,37.8 67.1,37.8 65.3,36 U$1.COL7
N$9  (via drill 0.33)
  Top 0.254: v56.6,53.9 62.7,60 U$1.ROW7
  Bottom 0.254: U$2.1R 53.7,53.9 v56.6,53.9
N$10  (via drill 0.33)
  Top 0.254: v69.9,55.8 70.3,56.2 70.3,60 U$1.ROW6
  Bottom 0.254: U$2.2R 53,53 64.2,53 67,55.8 v69.9,55.8
N$11  (via drill 0.33)
  Top 0.254: v55.4,54.6 57.6,56.8 57.6,60 U$1.ROW5
  Bottom 0.254: U$2.3R 52.5,54.6 v55.4,54.6
N$12
  Bottom 0.254: U$2.4R 52,53 49.8,53 49.3,53.5 49.3,58.2 71,58.2 72.8,60 U$1.ROW4
N$13  (via drill 0.33)
  Top 0.254: v53,55.4 62.7,45.7 62.7,36 U$1.ROW3
  Bottom 0.254: U$2.5R 51.5,54.8 52.1,54.8 52.7,55.4 v53,55.4
N$14  (via drill 0.33)
  Top 0.254: v52.2,55.8 55.1,58.7 U$1.ROW2
  Bottom 0.254: U$2.6R 51,54.9 51.9,55.8 v52.2,55.8
N$15  (via drill 0.33)
  Top 0.254: v68.5,56.5 68.5,36.6 67.9,36 U$1.ROW1
  Bottom 0.254: U$2.7R 50.5,55.2 50.7,55.2 52,56.5 v68.5,56.5
N$16  (via drill 0.33)
  Top 0.254: v50,55.6 52.2,53.4 52.2,38.9 U$1.ROW0
  Bottom 0.254: v50,55.6 U$2.8R
N$17
  Bottom 0.254: U$9.PD0 56.2,52 U$5.I1
N$18
  Bottom 0.254: U$9.PD1 57,48.2 58.4,48.2 60.4,50.2 65,50.2 66.2,51.4 66.2,52 U$5.I2
N$19  (via drill 0.33)
  Top 0.254: v61.4,50.9 62.7,49.6 v62.7,49.5
  Bottom 0.254: v61.4,50.9 59.4,50.9 57.8,49.3 U$9.PD2 | v62.7,49.5 62.9,49.7 65.8,49.7 67.5,51.4 67.5,52 U$5.I3
N$20
  Bottom 0.254: 59.3,47.8 U$9.PD3 59.4,47.8 60.4,48.8 66.2,48.8 68.8,51.4 U$5.I4
N$21
  Bottom 0.254: 59.3,47 U$9.PD4 | 59.4,47 U$9.PD4 | U$9.PD4 59.5,47 59.8,47.3 65.4,47.3 68.7,50.6 69.3,50.6 70,51.3 70,52 U$5.I5
N$22  (via drill 0.33)
  Top 0.254: v63.6,43.5 66.2,46.1 v66.2,47.2
  Bottom 0.254: 57.9,40.8 U$9.PD5 58,40.8 58.4,41.2 61.3,41.2 v63.6,43.5 | v66.2,47.2 69.1,50.1 70,50.1 71.3,51.4 71.3,52 U$5.I6
N$23  (via drill 0.33)
  Top 0.254: v63.6,42.6 67.1,46.1 v67.1,47.2
  Bottom 0.254: U$9.PD6 57,39.7 60.7,39.7 v63.6,42.6 | v67.1,47.2 67.6,47.7 68.9,47.7 72.6,51.4 72.6,52 U$5.I7
N$24
  Bottom 0.254: U$9.PD7 56.2,41.8 58.4,41.8 58.5,41.7 60,41.7 60.9,42.6 60.9,46.5 69,46.5 73.8,51.3 73.8,52 U$5.I8
N$25  (via drill 0.33)
  Top 0.254: v48.2,50.9 47.2,49.9 v47.2,46.8
  Bottom 0.254: U$2.R7 50.5,50.9 v48.2,50.9 | v47.2,46.8 47.8,46.2 U$9.PA1
N$26  (via drill 0.33)
  Top 0.254: v48.6,51.7 49.3,51 49.3,45.4 v48.6,44.7
  Bottom 0.254: U$2.R8 49.7,51.7 v48.6,51.7 | v48.6,44.7 48.7,44.6 U$9.PC7
N$27  (via drill 0.33)
  Top 0.254: v48.6,50.1 47.9,49.4 v47.9,47.3
  Bottom 0.254: U$2.R6 51,50.1 v48.6,50.1 | v47.9,47.3 48.2,47 U$9.PC0
N$28  (via drill 0.33)
  Top 0.254: v48.6,47.8 v48.6,49.2
  Bottom 0.254: U$2.R5 51.5,49.2 v48.6,49.2 | U$9.PC1 v48.6,47.8
N$29
  Bottom 0.254: U$2.R4 52,49.3 52.2,49.3 U$9.PC2
N$30
  Bottom 0.254: U$2.R3 52.5,50.2 53,49.7 U$9.PC3
N$31
  Bottom 0.254: U$2.R2 53,50.3 53.2,50.3 53.8,49.7 U$9.PC4
N$32
  Bottom 0.254: U$2.R1 53.5,51 54.6,49.9 U$9.PC5
N$33
  Bottom 0.406: U$25.7 132,39.78 132,43 135.07,43 C7.1
N$34
  Top 0.203: C3.1 80.85,33.85 80.25,33.25 80.25,32.5 80.35,32.4 U$23.4
N$35  (via drill 0.6)
  Top 0.406: C5.+ 129.24,34.76 v130,34
  Bottom 0.406: U$25.5 132.07,37.03 C6.1 130.61,34 v130,34
N$36  (via drill 0.33)
  Top 0.254: v102.2,46.8 105.4,43.6 105.4,36.5 U$3.COL0
  Bottom 0.254: U$4.O1 97,46.8 v102.2,46.8
N$37
  Bottom 0.406: C6.2 135.62,33.61 R7.2
N$38  (via drill 0.33)
  Top 0.254: v100,45.4 99.8,45.2 99.8,38.5 102.3,36 U$3.COL1
  Bottom 0.254: v100,45.4 98.3,45.4 98.3,43 U$4.O2
N$39  (via drill 0.33)
  Top 0.254: v98.6,46.1 94.9,42.4 94.9,38.7 U$3.COL2
  Bottom 0.254: v98.6,46.1 100.7,46.1 100.7,45.2 100.2,44.7 99.6,44.7 99.6,43 U$4.O3
N$40  (via drill 0.33)
  Top 0.254: v93.4,44.7 93.3,44.8 93.3,58.9 U$3.COL3
  Bottom 0.254: v93.4,44.7 96.5,41.6 100.8,41.6 100.8,42.9 U$4.O4
N$41  (via drill 0.33)
  Top 0.254: v98.6,39.6 95.8,36.8 95.8,34.7 94.8,33.7 89.7,33.7 89.7,36 U$3.COL4
  Bottom 0.254: v98.6,39.6 102,39.6 102,42.9 U$4.O5
N$42  (via drill 0.33)
  Top 0.254: v103.3,48.2 102.2,49.3 102.2,55.1 97.3,60 U$3.COL5
  Bottom 0.254: v103.3,48.2 103.3,43 U$4.O6
N$43  (via drill 0.33)
  Top 0.254: v104.6,48.2 102.8,50 102.8,57.1 99.9,60 U$3.COL6
  Bottom 0.254: v104.6,48.2 104.6,43 U$4.O7
N$44  (via drill 0.33)
  Top 0.254: v104.7,40.6 103.4,39.3 103.4,34.8 102.8,34.2 97.3,34.2 97.3,36 U$3.COL7
  Bottom 0.254: v104.7,40.6 105.8,40.6 105.8,42.9 U$4.O8
N$45  (via drill 0.33)
  Top 0.254: v94,55.4 94.7,56.1 94.7,60 U$3.ROW7
  Bottom 0.254: U$7.1R 85.7,53.9 92.5,53.9 v94,55.4
N$46  (via drill 0.33)
  Top 0.254: v103.3,57.6 102.4,58.5 102.4,60 U$3.ROW6
  Bottom 0.254: U$7.2R 85,53 92.3,53 94,54.7 94.3,54.7 95.2,55.6 101.3,55.6 v103.3,57.6
N$47  (via drill 0.33)
  Top 0.254: v89.7,54.6 89.7,60 U$3.ROW5
  Bottom 0.254: U$7.3R 84.5,54.6 v89.7,54.6
N$48
  Bottom 0.254: U$7.4R 84,55.1 89.3,55.1 90.3,56.1 100.9,56.1 104.8,60 U$3.ROW4
N$49  (via drill 0.33)
  Top 0.254: v88.4,55.8 89,55.2 89,52.8 91.1,50.7 91.1,34.8 91.7,34.2 94.7,34.2 94.7,36 U$3.ROW3
  Bottom 0.254: U$7.5R 83.5,55.8 v88.4,55.8
N$50  (via drill 0.33)
  Top 0.254: v82.8,55.7 83.4,56.3 83.4,57.3 86.1,60 U$3.ROW2
  Bottom 0.254: U$7.6R 83,55.7 v82.8,55.7
N$51  (via drill 0.33)
  Top 0.254: v97.1,56.8 99.3,54.6 99.3,36.5 U$3.ROW1
  Bottom 0.254: U$7.7R 82.5,55.1 82.1,55.5 82.1,56.4 88.2,56.4 88.6,56.8 v97.1,56.8
N$52  (via drill 0.33)
  Top 0.254: v84.1,57.1 89.8,51.4 89.8,38.6 87.2,36 U$3.ROW0
  Bottom 0.254: U$7.8R 82,55 81.6,55.4 81.6,57.1 v84.1,57.1
N$53
  Bottom 0.254: U$6.PD0 88.2,51 96,51 U$4.I1
N$54
  Bottom 0.254: U$6.PD1 89,50.5 97.3,50.5 98.2,51.4 98.2,52 U$4.I2
N$55
  Bottom 0.254: U$6.PD2 89.8,49.3 90.5,50 98.1,50 99.5,51.4 99.5,52 U$4.I3
N$56  (via drill 0.33)
  Top 0.254: v95.4,48.2 98.6,51.4 v98.6,54.4
  Bottom 0.254: v95.4,48.2 91.7,48.2 91.3,47.8 U$6.PD3 | v98.6,54.4 99.6,53.4 100,53.4 100.8,52.6 U$4.I4
N$57  (via drill 0.33)
  Top 0.254: v100,48.2 100.3,48.5 v100.3,54.4
  Bottom 0.254: v100,48.2 99.1,47.3 91.6,47.3 91.3,47 U$6.PD4 | v100.3,54.4 102,52.7 102,52 U$4.I5
N$58  (via drill 0.33)
  Top 0.254: v100.5,40.6 101.5,41.6 v101.5,54.4
  Bottom 0.254: 89.9,40.9 89.8,40.8 U$6.PD5 90,40.9 90.3,40.6 v100.5,40.6 | v101.5,54.4 103.3,52.6 103.3,52 U$4.I6
N$59  (via drill 0.33)
  Top 0.254: v93.4,39.7 94.4,40.7 94.4,45.4 v98.6,49.6
  Bottom 0.254: U$6.PD6 89,39.7 v93.4,39.7 | v98.6,49.6 99.6,50.6 103.8,50.6 104.6,51.4 104.6,52 U$4.I7
N$60  (via drill 0.33)
  Top 0.254: v93.4,41.7 92.6,42.5 v92.6,52.4
  Bottom 0.254: U$6.PD7 88.2,41.8 90.4,41.8 90.5,41.7 v93.4,41.7 | v92.6,52.4 95.3,55.1 103.4,55.1 105.8,52.7 105.8,52 U$4.I8
N$61
  Bottom 0.254: U$7.R7 82.5,48.8 81.9,48.8 81.2,48.1 81.2,46.2 U$6.PA1
N$62
  Bottom 0.254: U$7.R8 80.6,53.4 74.7,53.4 74.5,53.2 74.5,44.4 78.8,44.4 79.2,44 81.7,44 82.3,44.6 U$6.PC7
N$63
  Bottom 0.254: U$7.R6 83,48.3 82,48.3 81.7,48 81.7,47 U$6.PC0
N$64
  Bottom 0.254: U$6.PC1 83.5,47.8 U$7.R5
N$65
  Bottom 0.254: U$7.R4 84,49.3 84.2,49.3 U$6.PC2
N$66
  Bottom 0.254: U$7.R3 84.5,50.2 85,49.7 U$6.PC3
N$67
  Bottom 0.254: U$7.R2 85,50.3 85.2,50.3 85.8,49.7 U$6.PC4
N$68
  Bottom 0.254: U$7.R1 85.5,51 86.6,49.9 U$6.PC5
N$69  (via drill 0.33)
  Top 0.254: v112.1,17.4 v112.1,13.8
  Bottom 0.254: U$16.R7 109.5,13.8 v112.1,13.8 | v112.1,17.4 111.7,17.8 U$15.PA1
N$70  (via drill 0.33)
  Top 0.254: v57,23.1 55.2,24.9 55.2,28 U$8.COL0
  Bottom 0.254: U$10.O1 63,22.9 58.1,22.9 57.9,23.1 v57,23.1
N$71  (via drill 0.33)
  Top 0.254: v57.7,22.4 57.7,28 U$8.COL1
  Bottom 0.254: v57.7,22.4 61.7,22.4 61.7,20.1 U$10.O2
N$72  (via drill 0.33)
  Top 0.254: v64.4,18.6 67.8,22 U$8.COL2
  Bottom 0.254: v64.4,18.6 60.5,18.6 60.5,20 U$10.O3
N$73  (via drill 0.33)
  Top 0.254: v59.2,16.3 67.1,8.4 67.8,8.4 U$8.COL3
  Bottom 0.254: v59.2,16.3 U$10.O4
N$74  (via drill 0.33)
  Top 0.254: v58,17.6 63.4,23 63.4,26.4 64.2,27.2 64.2,29.3 65.2,30.3 70.3,30.3 70.3,28 U$8.COL4
  Bottom 0.254: v58,17.6 58,20 U$10.O5
N$75  (via drill 0.33)
  Top 0.254: v56.7,13.4 62.7,7.4 62.7,4 U$8.COL5
  Bottom 0.254: v56.7,13.4 56.7,20 U$10.O6
N$76  (via drill 0.33)
  Top 0.254: v55.4,13.4 60.2,8.6 U$8.COL6
  Bottom 0.254: v55.4,13.4 55.4,20 U$10.O7
N$77  (via drill 0.33)
  Top 0.254: v60.7,23.6 62.7,25.6 62.7,28 U$8.COL7
  Bottom 0.254: v60.7,23.6 60.5,23.8 54.2,23.8 54.2,20.1 U$10.O8
N$78  (via drill 0.33)
  Top 0.254: v67.1,7.7 65.3,5.9 65.3,4 U$8.ROW7
  Bottom 0.254: U$12.1R 74,9.8 69.2,9.8 v67.1,7.7
N$79  (via drill 0.33)
  Top 0.254: v59.5,7.2 57.7,5.4 57.7,4 U$8.ROW6
  Bottom 0.254: U$12.2R 75,11 64.8,11 61,7.2 v59.5,7.2
N$80  (via drill 0.33)
  Top 0.254: v72.4,7.7 70.4,5.7 70.4,4 U$8.ROW5
  Bottom 0.254: U$12.3R 75.5,9.3 74,9.3 v72.4,7.7
N$81  (via drill 0.33)
  Top 0.254: v57.8,6.9 55.2,4.3 55.2,4 U$8.ROW4
  Bottom 0.254: U$12.4R 76,11 78.2,11 78.9,10.3 78.9,6.5 58.2,6.5 v57.8,6.9
N$82  (via drill 0.33)
  Top 0.254: v74.2,8.6 68.9,13.9 68.9,29.2 68.3,29.8 65.3,29.8 65.3,28 U$8.ROW3
  Bottom 0.254: U$12.5R 76.5,8.6 v74.2,8.6
N$83  (via drill 0.33)
  Top 0.254: v76.8,7.9 U$8.ROW2
  Bottom 0.254: U$12.6R 77,7.9 v76.8,7.9
N$84  (via drill 0.33)
  Top 0.254: v64.7,9.2 57.1,16.8 57.1,20.9 60.1,23.9 60.1,28 U$8.ROW1
  Bottom 0.254: U$12.7R 77.5,7 66.9,7 v64.7,9.2
N$85  (via drill 0.33)
  Top 0.254: v78.2,8.6 75.8,11 75.8,25.1 U$8.ROW0
  Bottom 0.254: U$12.8R 78,8.6 v78.2,8.6
N$86  (via drill 0.33)
  Top 0.254: v64.4,12 v66.3,13.9
  Bottom 0.254: U$11.PD0 71.8,15.8 69.6,15.8 67.7,13.9 v66.3,13.9 | v64.4,12 63.4,11 U$10.I1
N$87
  Bottom 0.254: U$11.PD1 71,13.3 69.4,13.3 68.8,12.7 62.9,12.7 61.8,11.6 61.8,11 U$10.I2
N$88
  Bottom 0.254: U$11.PD2 70.2,14.7 68.7,13.2 62.1,13.2 60.5,11.6 60.5,11 U$10.I3
N$89
  Bottom 0.254: U$11.PD3 68.7,16.2 67.1,14.6 62.2,14.6 59.2,11.6 U$10.I4
N$90
  Bottom 0.254: 68.7,17 U$11.PD4 68.6,17 68.5,16.9 63.2,16.9 58,11.7 58,11 U$10.I5
N$91  (via drill 0.33)
  Top 0.254: v65,23 60.8,18.8 v60.8,15.7
  Bottom 0.254: v65,23 70,23 70.2,23.2 U$11.PD5 | v60.8,15.7 56.7,11.6 56.7,11 U$10.I6
N$92  (via drill 0.33)
  Top 0.254: v52.6,25.4 54,24 v54,13.7
  Bottom 0.254: U$11.PD6 71,25.5 52.7,25.5 v52.6,25.4 | v54,13.7 55.3,12.4 55.3,11 U$10.I7
N$93
  Bottom 0.254: U$11.PD7 71.8,26.1 47.5,26.1 39,17.6 39,9.6 53.3,9.6 54.1,10.4 U$10.I8
N$94  (via drill 0.33)
  Top 0.254: v79.4,13 80.8,14.4 v80.8,17.2
  Bottom 0.254: U$12.R7 77.5,13 v79.4,13 | v80.8,17.2 80.2,17.8 U$11.PA1
N$95  (via drill 0.33)
  Top 0.254: v79.9,12.3 81.5,13.9 v81.5,17.7
  Bottom 0.254: U$12.R8 78.3,12.3 v79.9,12.3 | v81.5,17.7 79.8,19.4 U$11.PC7
N$96  (via drill 0.33)
  Top 0.254: v79.4,13.9 80.1,14.6 v80.1,16.7
  Bottom 0.254: U$12.R6 77,13.9 v79.4,13.9 | v80.1,16.7 79.8,17 U$11.PC0
N$97  (via drill 0.33)
  Top 0.254: v79.4,16.2 v79.4,14.8
  Bottom 0.254: U$12.R5 76.5,14.8 v79.4,14.8 | U$11.PC1 v79.4,16.2
N$98
  Bottom 0.254: U$12.R4 76,14.7 75.8,14.7 U$11.PC2
N$99
  Bottom 0.254: U$12.R3 75.5,13.8 75,14.3 U$11.PC3
N$100
  Bottom 0.254: U$12.R2 75,13.7 74.8,13.7 74.2,14.3 U$11.PC4
N$101
  Bottom 0.254: U$12.R1 74.5,13 73.4,14.1 U$11.PC5
N$102  (via drill 0.33)
  Top 0.254: v111.4,19 v111.4,13.1
  Bottom 0.254: U$16.R8 111.1,13.1 v111.4,13.1 | v111.4,19 111,19.4 U$15.PC7
N$103  (via drill 0.33)
  Top 0.254: v89.4,18.6 87.2,20.8 87.2,28 U$13.COL0
  Bottom 0.254: v89.4,18.6 90.5,18.6 90.5,22.2 90.7,22.4 91.8,22.4 91.8,19.7 92.4,19.1 99.3,19.1 99.3,22.5 98.8,23 98.4,23 97,21.6 95.5,21.6 95,21.1 U$14.O1
N$104  (via drill 0.33)
  Top 0.254: v96.4,22.3 93.3,25.4 93.3,29.1 92.6,29.8 89.7,29.8 89.7,28 U$13.COL1
  Bottom 0.254: v96.4,22.3 96.3,22.4 93.8,22.4 93.8,21.1 U$14.O2
N$105  (via drill 0.33)
  Top 0.254: v98.6,22.3 99.8,23.5 U$13.COL2
  Bottom 0.254: v98.6,22.3 95.9,19.6 92.5,19.6 92.5,21 U$14.O3
N$106  (via drill 0.33)
  Top 0.254: v93.6,18.4 99.8,12.2 U$13.COL3
  Bottom 0.254: v93.6,18.4 91.2,18.4 U$14.O4
N$107  (via drill 0.33)
  Top 0.254: v97.2,22.8 98.4,21.6 100,21.6 100,23.1 102.2,25.3 102.2,27.9 102.3,28 U$13.COL4
  Bottom 0.254: v97.2,22.8 97,23 90,23 90,21.1 U$14.O5
N$108  (via drill 0.33)
  Top 0.254: v83.6,22.4 85.4,20.6 85.4,8 88.6,4.8 88.6,2.8 89.2,2.2 94.7,2.2 94.7,4 U$13.COL5
  Bottom 0.254: v83.6,22.4 88.6,22.4 88.6,21.1 U$14.O6
N$109  (via drill 0.33)
  Top 0.254: v87.4,18.4 89.4,16.4 89.4,11.5 92.2,8.7 U$13.COL6
  Bottom 0.254: v87.4,18.4 87.4,21 U$14.O7
N$110  (via drill 0.33)
  Top 0.254: v86.1,18.6 86,18.7 86,29.1 87.2,30.3 94.7,30.3 94.7,28 U$13.COL7
  Bottom 0.254: v86.1,18.6 U$14.O8
N$111  (via drill 0.33)
  Top 0.254: v99.1,9.2 97.3,7.4 97.3,4 U$13.ROW7
  Bottom 0.254: U$16.1R 105.4,9.2 v99.1,9.2
N$112  (via drill 0.33)
  Top 0.254: v91.5,8.5 89.7,6.7 89.7,4 U$13.ROW6
  Bottom 0.254: U$16.2R 107,8.5 v91.5,8.5
N$113  (via drill 0.33)
  Top 0.254: v106.2,7.8 102.4,4 U$13.ROW5
  Bottom 0.254: U$16.3R 107.5,7.8 v106.2,7.8
N$114
  Bottom 0.254: U$16.4R 108,7.1 90.3,7.1 87.2,4 U$13.ROW4
N$115  (via drill 0.33)
  Top 0.254: v108.7,8.6 108.3,9 108.3,26.8 102.8,32.3 97.3,32.3 97.3,28 U$13.ROW3
  Bottom 0.254: U$16.5R 108.5,8.6 v108.7,8.6
N$116
  Bottom 0.254: U$16.6R 109,11 110.2,11 111,10.2 111,4 U$13.ROW2
N$117  (via drill 0.33)
  Top 0.254: v95.9,6.4 92.8,9.5 92.8,27.4 U$13.ROW1
  Bottom 0.254: U$16.7R 109.5,9.2 109.9,8.8 109.9,6.4 v95.9,6.4
N$118  (via drill 0.33)
  Top 0.254: v110.3,5.9 107.8,8.4 107.8,25.1 U$13.ROW0
  Bottom 0.254: U$16.8R 110,9.3 110.4,8.9 110.4,5.9 v110.3,5.9
N$119
  Bottom 0.254: U$15.PD0 103.8,13.2 96.2,13.2 U$14.I1
N$120
  Bottom 0.254: U$15.PD1 103,13.7 94.9,13.7 93.8,12.6 93.8,12 U$14.I2
N$121
  Bottom 0.254: U$15.PD2 102.2,14.7 101.7,14.2 94.1,14.2 92.5,12.6 92.5,12 U$14.I3
N$122  (via drill 0.33)
  Top 0.254: v93.5,14.8 v94.9,16.2
  Bottom 0.254: v94.9,16.2 U$15.PD3 | v93.5,14.8 92.1,13.4 92,13.4 91.2,12.6 U$14.I4
N$123  (via drill 0.33)
  Top 0.254: v91.6,16.9 91.2,16.5 v91.2,14.4
  Bottom 0.254: v91.6,16.9 100.6,16.9 100.7,17 U$15.PD4 | v91.2,14.4 91.2,14.1 90,12.9 90,12 U$14.I5
N$124  (via drill 0.33)
  Top 0.254: v92.1,24.2 90.1,22.2 v90.1,14.4
  Bottom 0.254: v92.1,24.2 101.3,24.2 102.2,23.3 U$15.PD5 | v90.1,14.4 88.7,13 88.7,12 U$14.I6
N$125  (via drill 0.33)
  Top 0.254: v102.9,25.4 100.5,23 v100.5,10.7
  Bottom 0.254: U$15.PD6 103,25.4 v102.9,25.4 | v100.5,10.7 99.9,10.1 88.1,10.1 87.4,10.8 87.4,12 U$14.I7
N$126  (via drill 0.33)
  Top 0.254: v103.8,25.4 101.4,23 v101.4,12.5
  Bottom 0.254: v103.8,25.4 U$15.PD7 | v101.4,12.5 99.5,10.6 88.2,10.6 88,10.8 88,13.4 86.9,13.4 86.2,12.7 86.2,12 U$14.I8
N$129
  Bottom 0.254: U$16.R6 109,14.5 113.7,14.5 113.9,14.3 114.5,14.3 115.4,15.2 115.4,16.7 109.6,16.7 109.3,17 U$15.PC0
N$130
  Bottom 0.254: U$16.R5 108.5,15 113.8,15 114,14.8 114.4,14.8 114.9,15.3 114.9,16.2 U$15.PC1
N$131
  Bottom 0.254: U$16.R4 108,14.7 107.8,14.7 U$15.PC2
N$132
  Bottom 0.254: U$16.R3 107.5,13.8 107,14.3 U$15.PC3
N$133
  Bottom 0.254: U$16.R2 107,13.7 106.8,13.7 106.2,14.3 U$15.PC4
N$134
  Bottom 0.254: U$16.R1 106.5,13 105.4,14.1 U$15.PC5
RESET  (via drill 0.33)
  Top 0.254: J1.5 43.2,47.5 42,46.3 42,44.5 42.5,44 42.5,43.7 44.4,43.7 44.5,43.6 44.5,18.8 43.3,17.6 J3.5 43.2,17.5 42,16.3 42,13.8 v41.9,13.7 41.9,13.6 42,13.5 42,11.4 51.2,2.2 69.3,2.2 v69.3,11.7 | 120.45,16.75 120.5,16.8 120.5,45.3 119.3,46.5 J2.5 | 120.45,16.75 119.3,15.6 J4.5 | v114.2,15.5 115,14.7 115,13 116.3,11.7 120.5,11.7 120.5,16.7 120.45,16.75
  Bottom 0.254: v41.9,13.7 45.9,13.7 46,13.8 R9.1 | 45.15,45.75 43.4,47.5 43.3,47.5 J1.5 | 45.15,45.75 46,44.9 R6.1 | U$9.PC6 55.4,48.2 51.6,48.2 51.3,48.5 47.9,48.5 45.15,45.75 | R8.1 113,12.9 113.9,13.8 115.8,13.8 116.3,14.3 118,14.3 119.2,15.5 J4.5 | J2.5 119.2,46.5 118,45.3 114.4,45.3 113,43.9 R5.1 112.9,43.9 107.9,48.9 91.1,48.9 90.4,48.2 87.4,48.2 U$6.PC6 | v114.2,15.5 108.7,15.5 108.4,15.8 105.1,15.8 104.6,15.3 U$15.PC6 104.6,15.2 104,15.8 102,15.8 101.7,15.5 76.7,15.5 76.4,15.8 72.6,15.8 U$11.PC6 72.5,14.7 72.5,14.2 71.1,12.8 70.4,12.8 v69.3,11.7
RIGHT  (via drill 0.33)
  Top 0.254: v37.3,39.4 37.3,38.7 36.2,38.7 U$19.2 | v47.4,61.6 47.7,61.6 49.2,63.1 133.7,63.1 133.7,61.1 136.9,57.9 v136.9,55.4 | v138.1,46.4 140.4,48.7 140.4,49.6 141.4,50.6 141.4,51.2 PI-HEADER.12
  Bottom 0.254: v37.3,39.4 37.3,54.7 40.5,54.7 v47.4,61.6 | v136.9,55.4 136.9,52.3 137.8,51.4 137.8,46.4 v138.1,46.4
SCK  (via drill 0.33)
  Top 0.254: v79.4,21.7 80.1,21 80.1,18.5 79.6,18 76.3,18 76.3,28.7 75.1,29.9 75.1,30.9 | 75.1,30.9 75.1,35.9 78.7,39.5 v78.7,41.3 | J1.3 44.1,45 v46.9,42.2 46.9,18.6 43.3,15 J3.3 | 75.1,30.9 71.9,30.9 68.6,34.2 50.1,34.2 50.1,40.8 v48.6,42.3 | J4.3 119.2,13 118,14.2 118,18.9 v115.1,21.8 115.1,21.9 118,24.8 118,32.8 | 118,32.8 118,42.8 119.2,44 J2.3 | v117.9,32.8 118,32.8
  Bottom 0.254: 50.7,42.2 U$9.PB5 48.6,42.2 | 109.3,21.8 U$15.PB5 v115.1,21.8 | v79.4,21.7 77.4,21.7 77.3,21.8 U$11.PB5 | U$6.PB5 79.6,42.2 v78.7,41.3 78.6,41.3 77.3,40 77.3,36 84.3,36 87.5,32.8 v117.9,32.8 | v46.9,42.2 48.6,42.2 | v48.6,42.3 48.6,42.2 | PI-HEADER.23 156.7,38 153.8,38 125,9.2 118.2,9.2 118,9.4 118,13 J4.3
SCL  (via drill 0.33)
  Top 0.254: 83.4,29.2 R2.2 82.47,30.18 | U$23.2 81.9,31.6 82.25,31.25 82.25,30.4 82.47,30.18 | v127.5,30.4 133.8,36.7 133.8,48.7 PI-HEADER.5 | v82.4,30.1 82.47,30.18
  Bottom 0.254: v82.4,30.1 82.7,30.4 v127.5,30.4
SDA  (via drill 0.33)
  Top 0.203: U$23.10 79.15,31.15 R1.1
  Top 0.254: v80.2,28.7 R1.1 | v121.7,29.7 127,35 127,36.7 128.4,38.1 131.3,38.1 PI-HEADER.3
  Bottom 0.254: v80.2,28.7 80.4,28.5 85.4,28.5 86.7,29.8 121.6,29.8 v121.7,29.7
SELECT  (via drill 0.33)
  Top 0.254: v84.8,62.4 49.1,62.4 40.8,54.1 U$26.1 | v141.4,55.4 v134.4,62.4
  Bottom 0.254: v134.4,62.4 v84.8,62.4 | v141.4,55.4 145.4,51.4 145.4,48.8 146.5,48.8 PI-HEADER.15
SPK
  Top 0.254: U$29.1 127.7,49.8 127.7,40.5 128,40.2 C5.-
SS  (via drill 0.33)
  Top 0.254: v74.2,31.6 74.5,31.9 74.5,36.2 74.95,36.65 | v78,39.7 74.95,36.65 | 74.95,36.65 v71.8,39.8 | v105.2,25.4 103.4,27.2 103.4,29.2 v101,31.6 | PI-HEADER.24 156.7,51.2 156,50.5 155.6,50.1 155.5,50 v155.5,45.5
  Bottom 0.254: U$11.PB2 v74.2,31.6 v101,31.6 | v78,39.7 80,41.7 83.9,41.7 84,41.8 85.2,41.8 85.8,41.2 U$6.PB2 | U$9.PB2 53.8,39.2 71.2,39.2 v71.8,39.8 | 106.2,25.4 U$15.PB2 | v105.2,25.4 106.2,25.4 | 106.2,25.4 140.6,25.4 155.5,40.3 v155.5,45.5 155.5,45.75
START  (via drill 0.33)
  Top 0.254: v36.1,54.1 32.8,54.1 U$24.1 | v85.6,61.4 86.3,61.4 86.7,61.8 123.6,61.8 v123.6,61.2
  Bottom 0.254: v36.1,54.1 44.3,62.3 79.8,62.3 80.7,61.4 v85.6,61.4 | v123.6,61.2 126.4,58.4 138.4,58.4 140.4,56.4 140.4,49.8 142.5,49.8 143.5,48.8 144,48.8 PI-HEADER.13
UP  (via drill 0.33)
  Top 0.254: v47.1,2.2 26.3,23 26.3,26.1 24.9,27.5 24.9,49.9 24.2,50.6 U$17.2
  Bottom 0.254: v47.1,2.2 121.5,2.2 157.8,38.5 157.8,50.2 155.2,50.2 154.2,51.2 PI-HEADER.22
VCC  (via drill 0.33, 0.6)
  Top 0.203: C4.1 78.1,32 U$23.8 79.75,32 | R1.2 80.85,31.15 U$23.1 80,31.2 80,32 79.75,32 | R2.1 85.1,30.25 C1.1 C2.1 | 80,35.38 80,33.62 79.75,33.38 79.75,32
  Top 0.254: 86,31.1 C1.1 | 80.9,29.7 R1.2 80.9,29.6 80.9,27.9 82.5,27.9 | 53,44.9 C8.1 53.2,44.8 | 82.9,32.1 83.7,31.3 83.7,31.2 C2.1 | J1.2 40.8,42.4 41.5,41.7 41.5,18.5 42,18 42,17 41.3,16.3 39.5,16.3 39.5,13.7 40.7,12.5 J3.2 | U$30.4 133.9,55.4 v131.4,55.4 | J4.2 116.7,10.4 111.5,5.2 106.9,5.2 106.9,16.8 106.85,17 | 82.5,27.9 84.1,27.9 84.7,28.5 84.7,28.8 85.1,29.2 R2.1 | v82.5,21.1 82.5,27.9 | v80.1,42.9 80.1,35.4 80,35.38 | v114.4,21.1 114.4,39.1 116.7,41.4 J2.2
  Top 0.406: v107,21 107,19 C10.1 106.85,17 v104,17 | v75,21 75,19 C11.1 74.85,17 v72,17 | v56,47 53.15,47 C8.1 | 53,44.9 v53,43 | v85,43 85,44.85 C9.1 85.15,47 v88,47
  Bottom 0.254: 109.4,20.9 U$15.AVCC | 109.5,20.9 U$15.AVCC | U$9.AVCC 50.6,43.1 46,43.1 R6.2 45.9,43.2 45.6,43.5 44.6,43.5 44.4,43.7 42,43.7 40.8,42.5 J1.2 | J3.2 40.8,12.4 42,11.2 45.1,11.2 46,12.1 R9.2 46.1,12.2 46.9,12.2 46.9,14.1 52.8,20 U$10.COMMON 52.9,20.1 52.9,24.3 62.6,24.3 68.2,18.7 68.6,18.7 U$11.VCC | J2.2 116.6,41.6 116,42.2 113,42.2 R5.2 112.9,42.2 112.2,42.9 107.2,42.9 U$4.COMMON | v131.4,55.4 123,47 123,40 | R8.2 113,11.1 113.6,10.5 116.7,10.5 J4.2 | U$6.AVCC 80.1,43 | 80.1,43 75.2,43 U$5.COMMON | U$11.AVCC 82.5,21 | 82.5,21 82.9,21 | 82.9,21 84.8,21 U$14.COMMON | v82.5,21.1 82.5,21 | v80.1,42.9 80.1,43 | U$15.VCC 100.6,18.5 100.4,18.3 94.4,18.3 93.8,17.7 86.1,17.7 82.9,20.9 82.9,21 | v114.4,21.1 114.2,20.9 109.6,20.9 U$15.AVCC
  Bottom 0.406: v107,21 U$15.AVCC | v75,21 U$11.AVCC | U$9.VCC 58,45.4 58,46 57,47 v56,47 | v72,17 71,17 70,18 70,18.6 U$11.VCC | v53,43 U$9.AVCC | U$15.VCC 102,18.6 102,18 103,17 v104,17 | v85,43 U$6.AVCC | v88,47 89,47 90,46 90,45.4 U$6.VCC | U$25.6 130,39.13 130,37.5 123,37.5 123,40 116.73,40 J2.2

### Text on the board
tPlace: B7 | B8 | J9 | J8 | J7 | J5 | GND | RESET | GND | RESET | J6 | B3 | MOSI | SCK | MOSI | SCK | VCC | MISO | J1 | VCC | MISO | J11 | B1 | B6 | B4 | J10 | J15 | J14 | B5 | B2 | GND | RESET | GND | RESET | MOSI | SCK | MOSI | SCK | VCC | MISO | J4 | VCC | MISO | J13 | J12 | J3
bPlace: U2 | U4 | U1 | U3 | U7 | U5 | U6 | U8